# EasyEDA Pro project GController.eprj, schematic NController, sheets 11 to 17 of 17

## Sheets
11 Analog-Input: Create Date: 2024-10-03
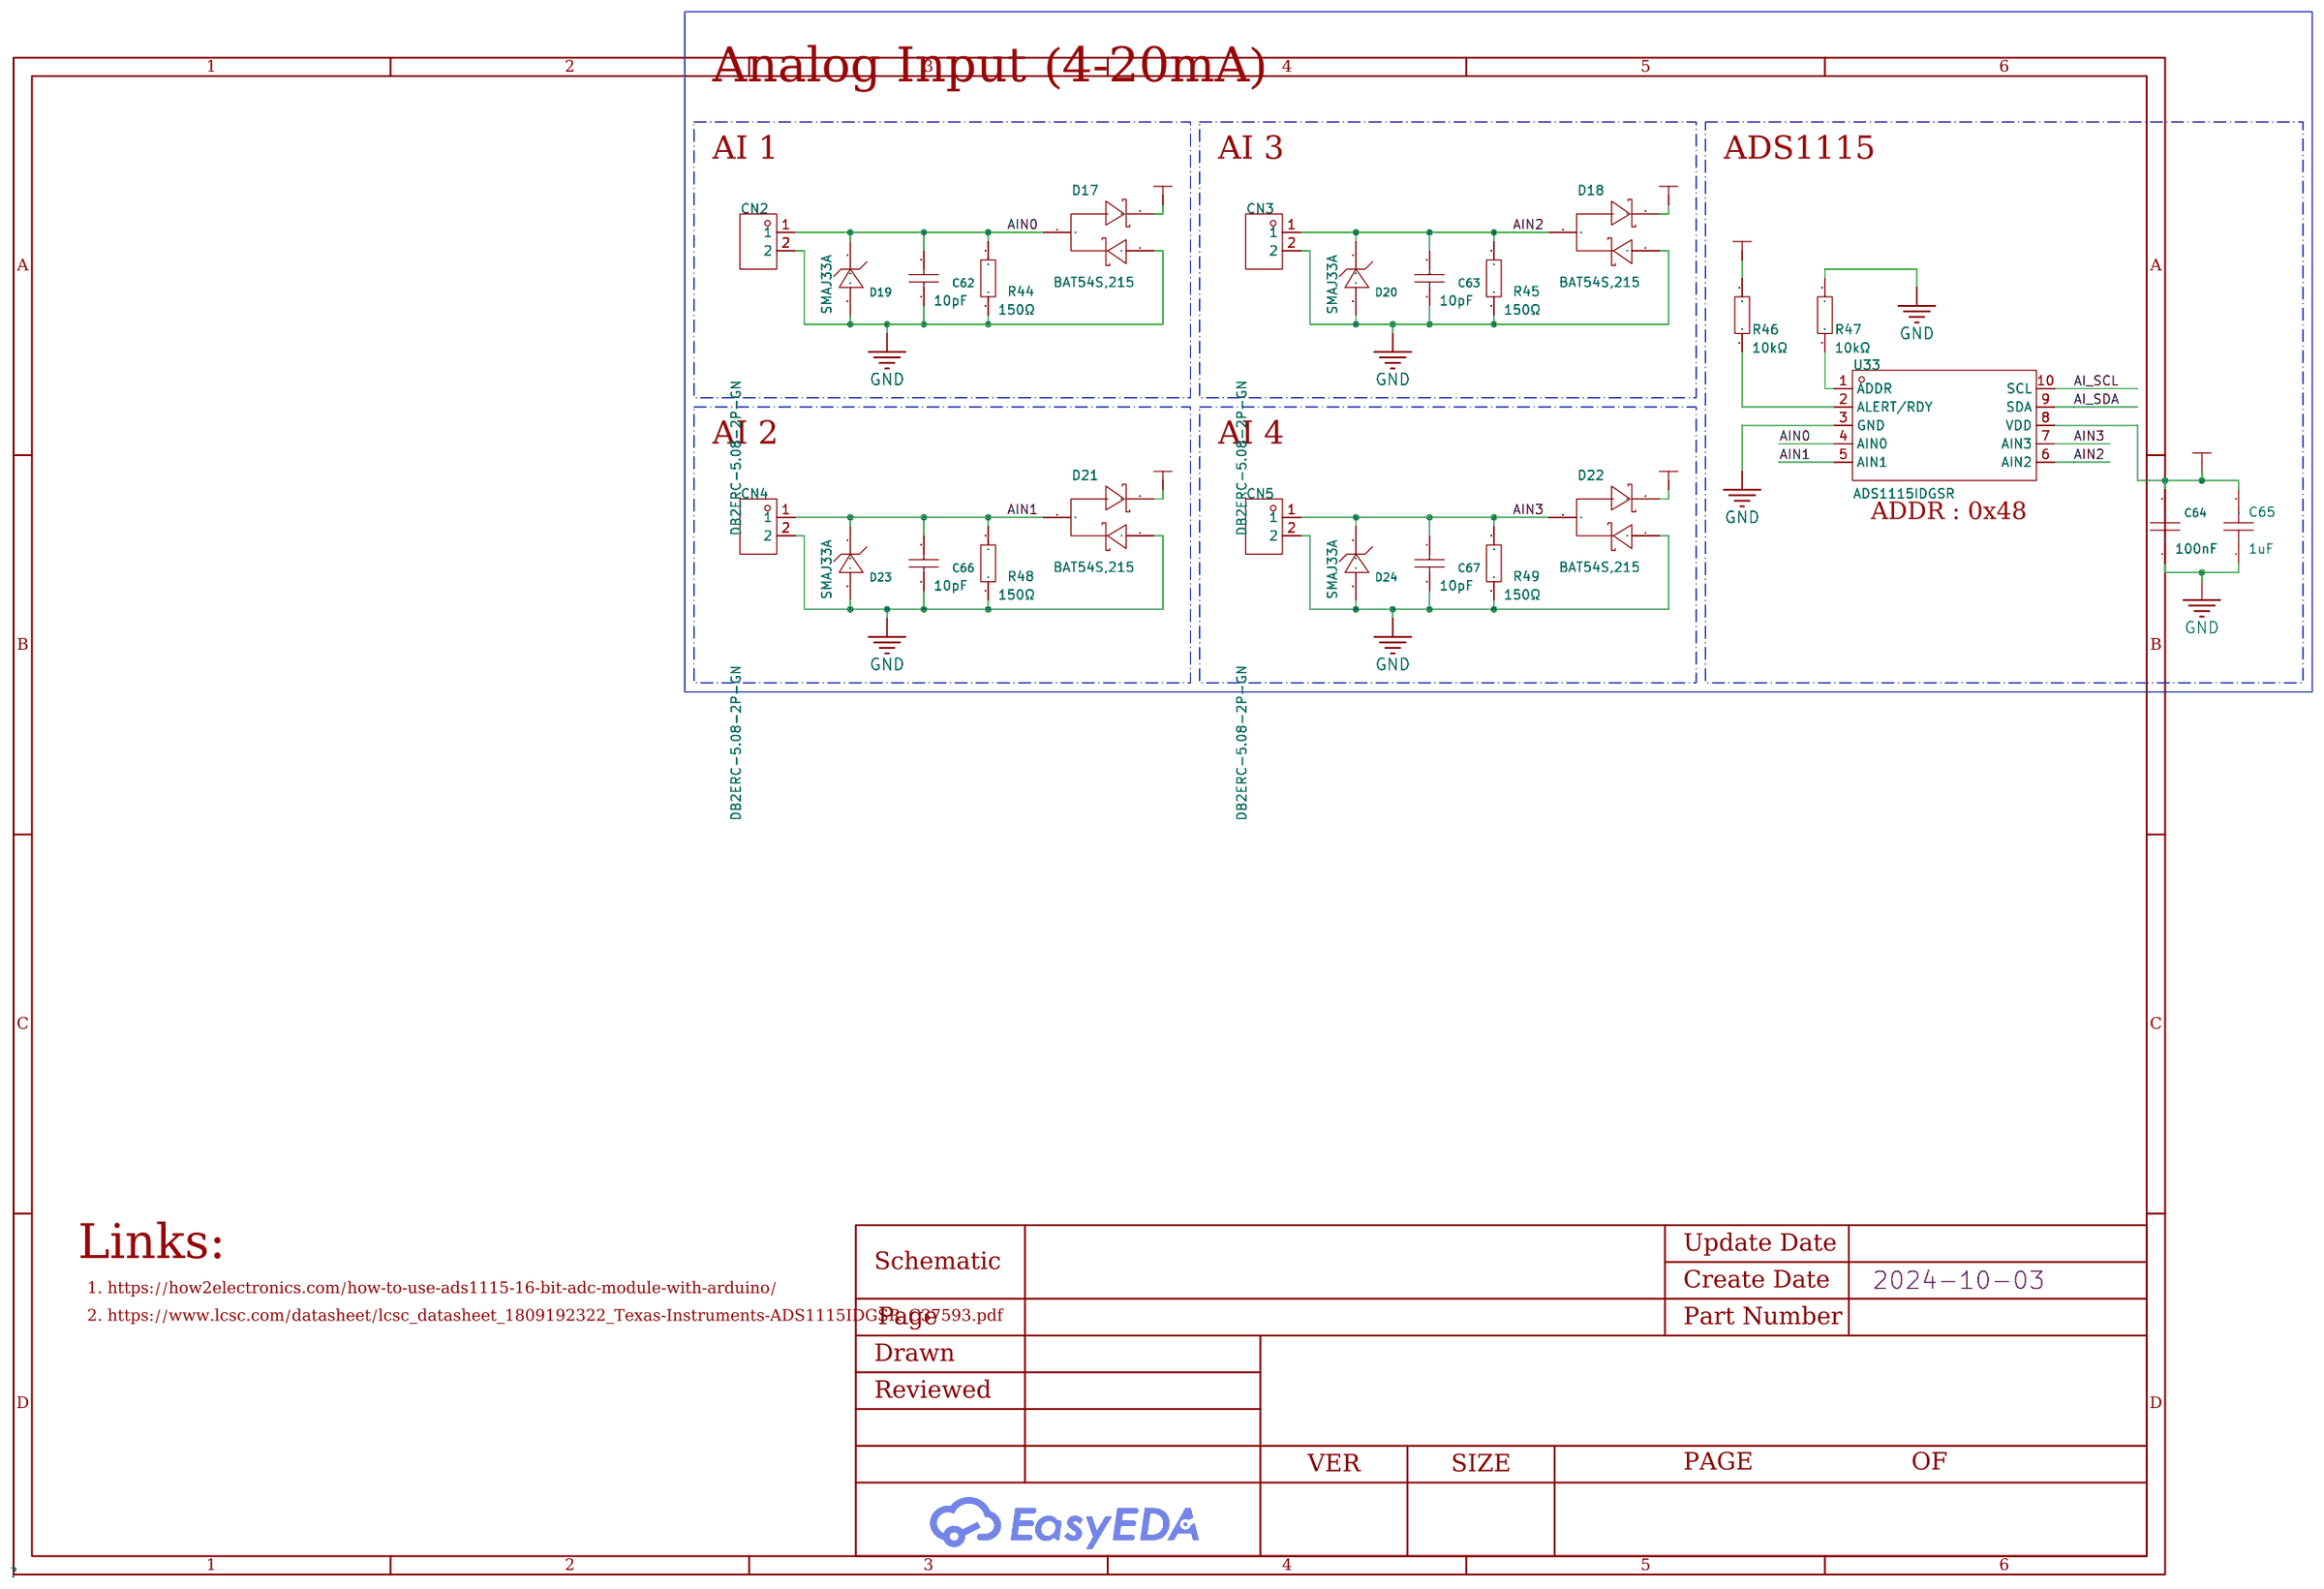
[diagram p10: Analog-Input]
12 Digital-Input: Create Date: 2024-10-06
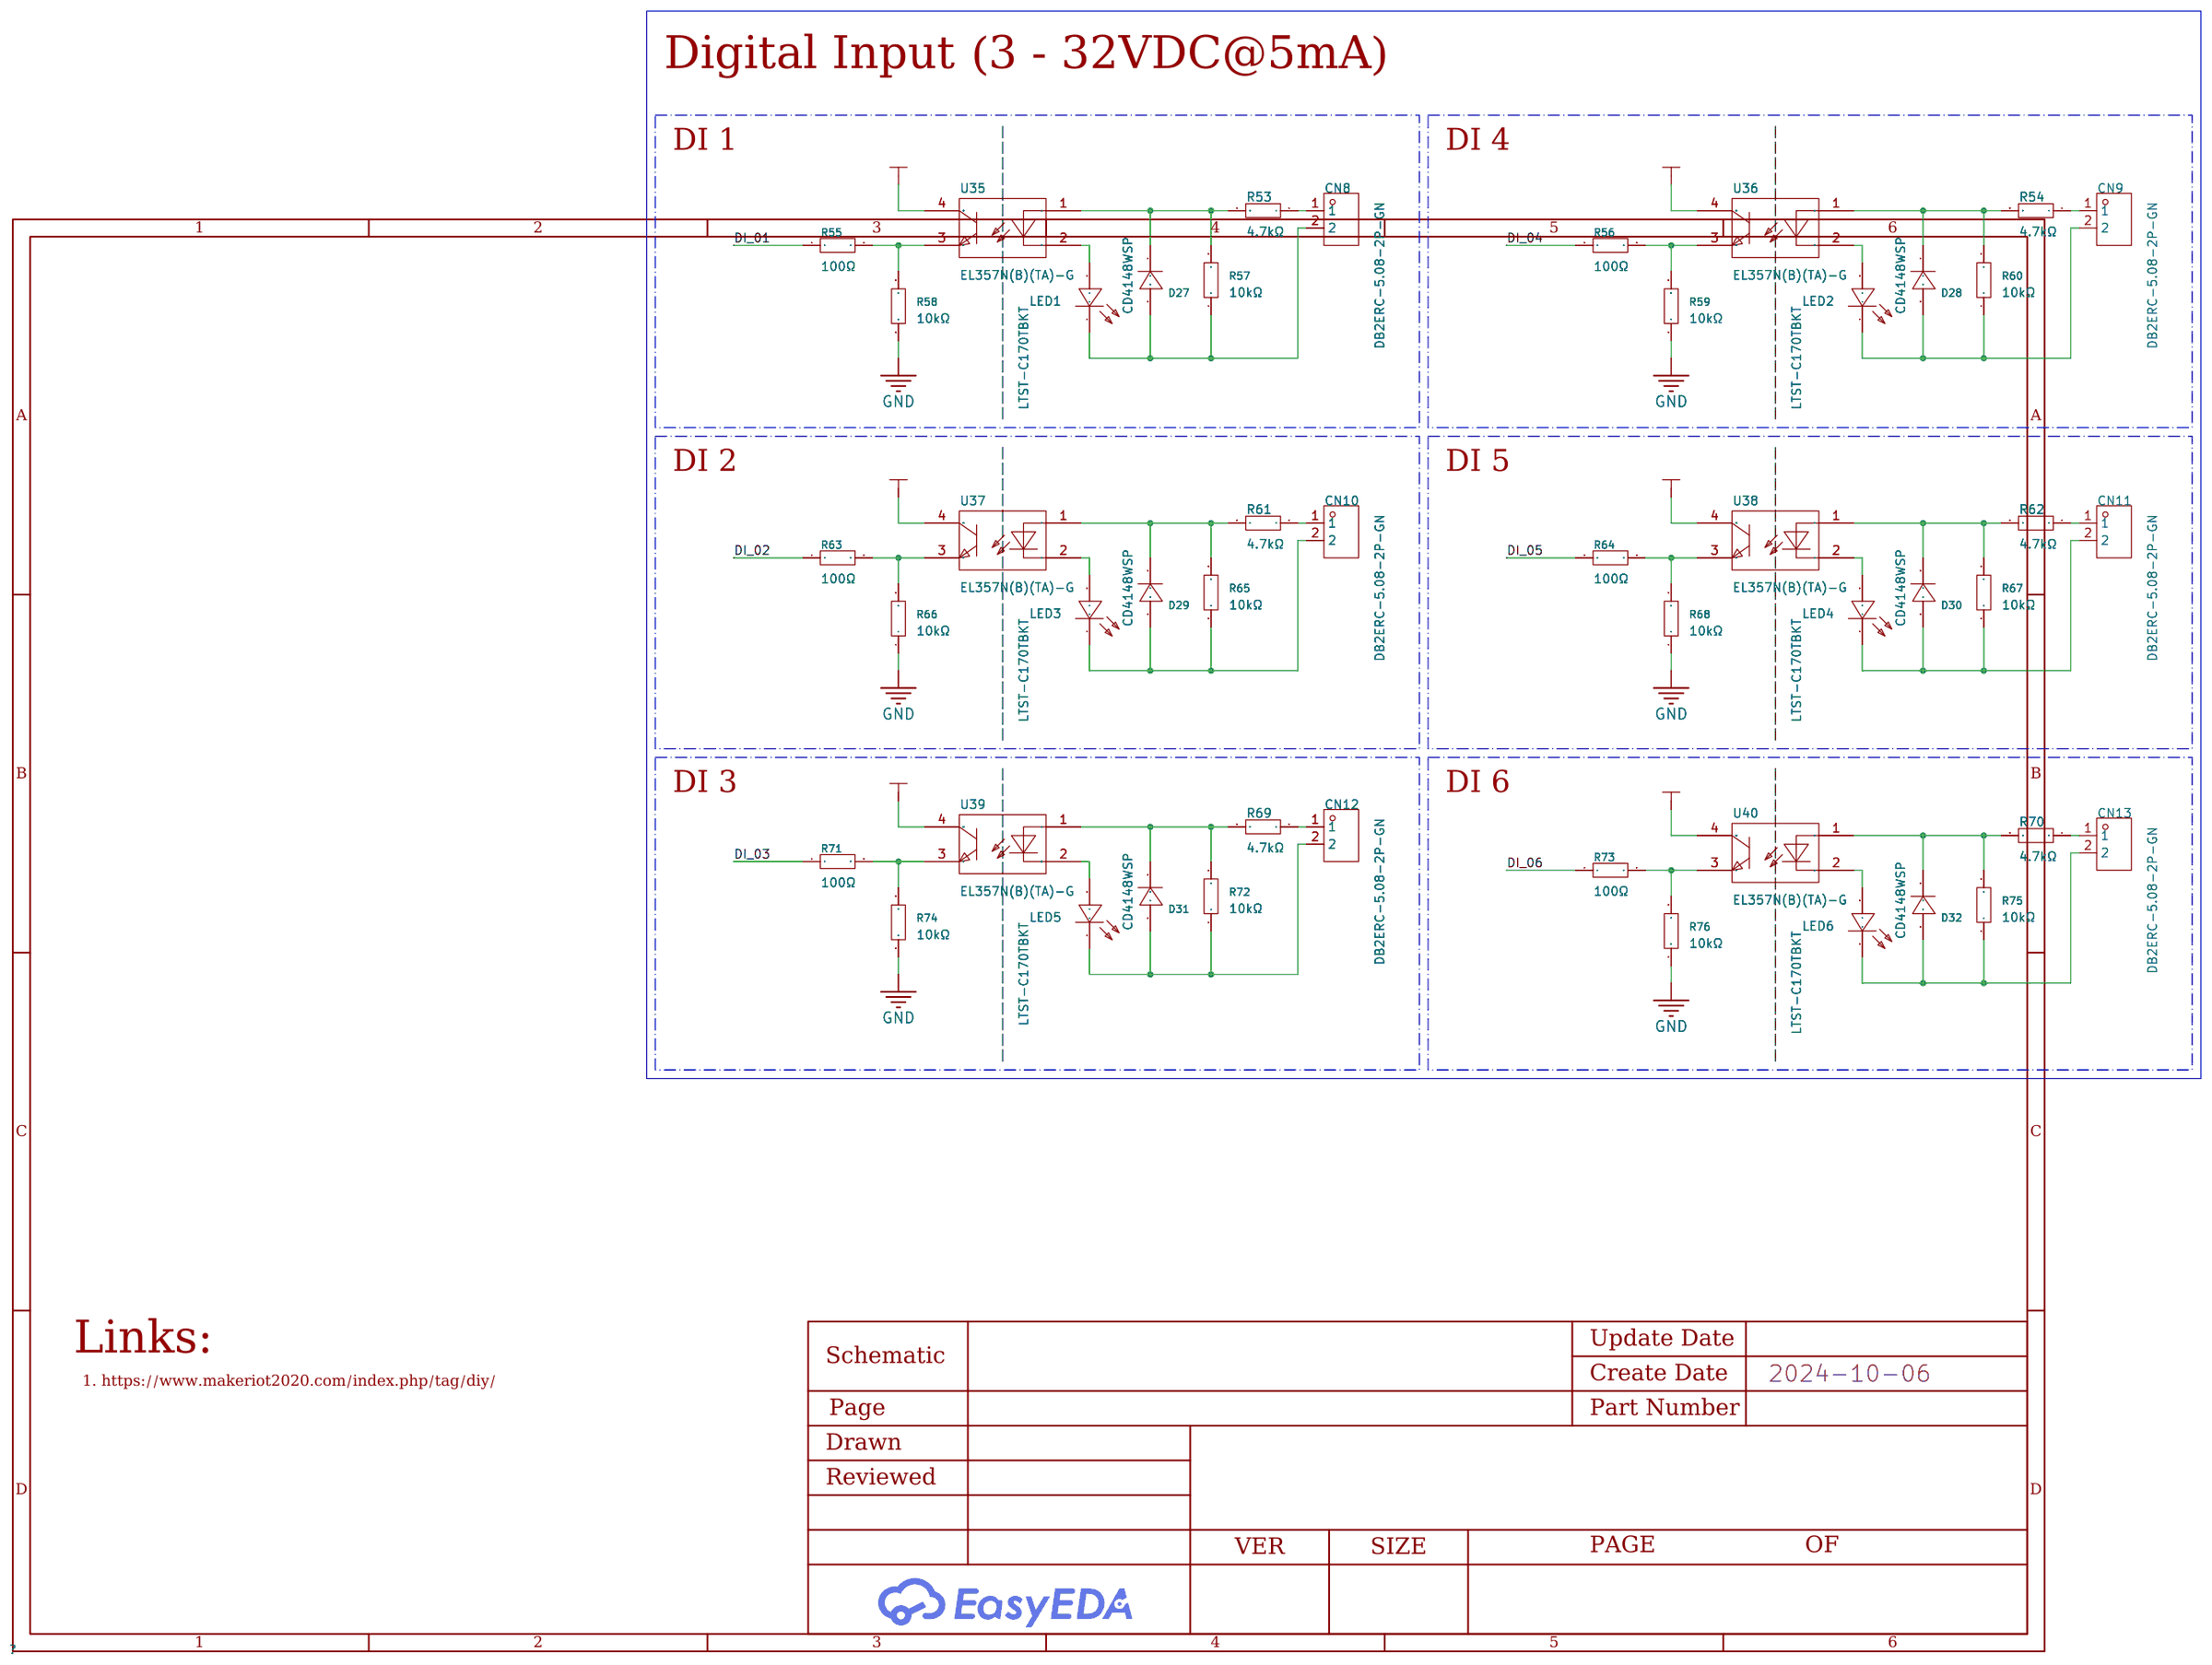
[diagram p11: Digital-Input]
13 Analog-Output: Create Date: 2024-10-07
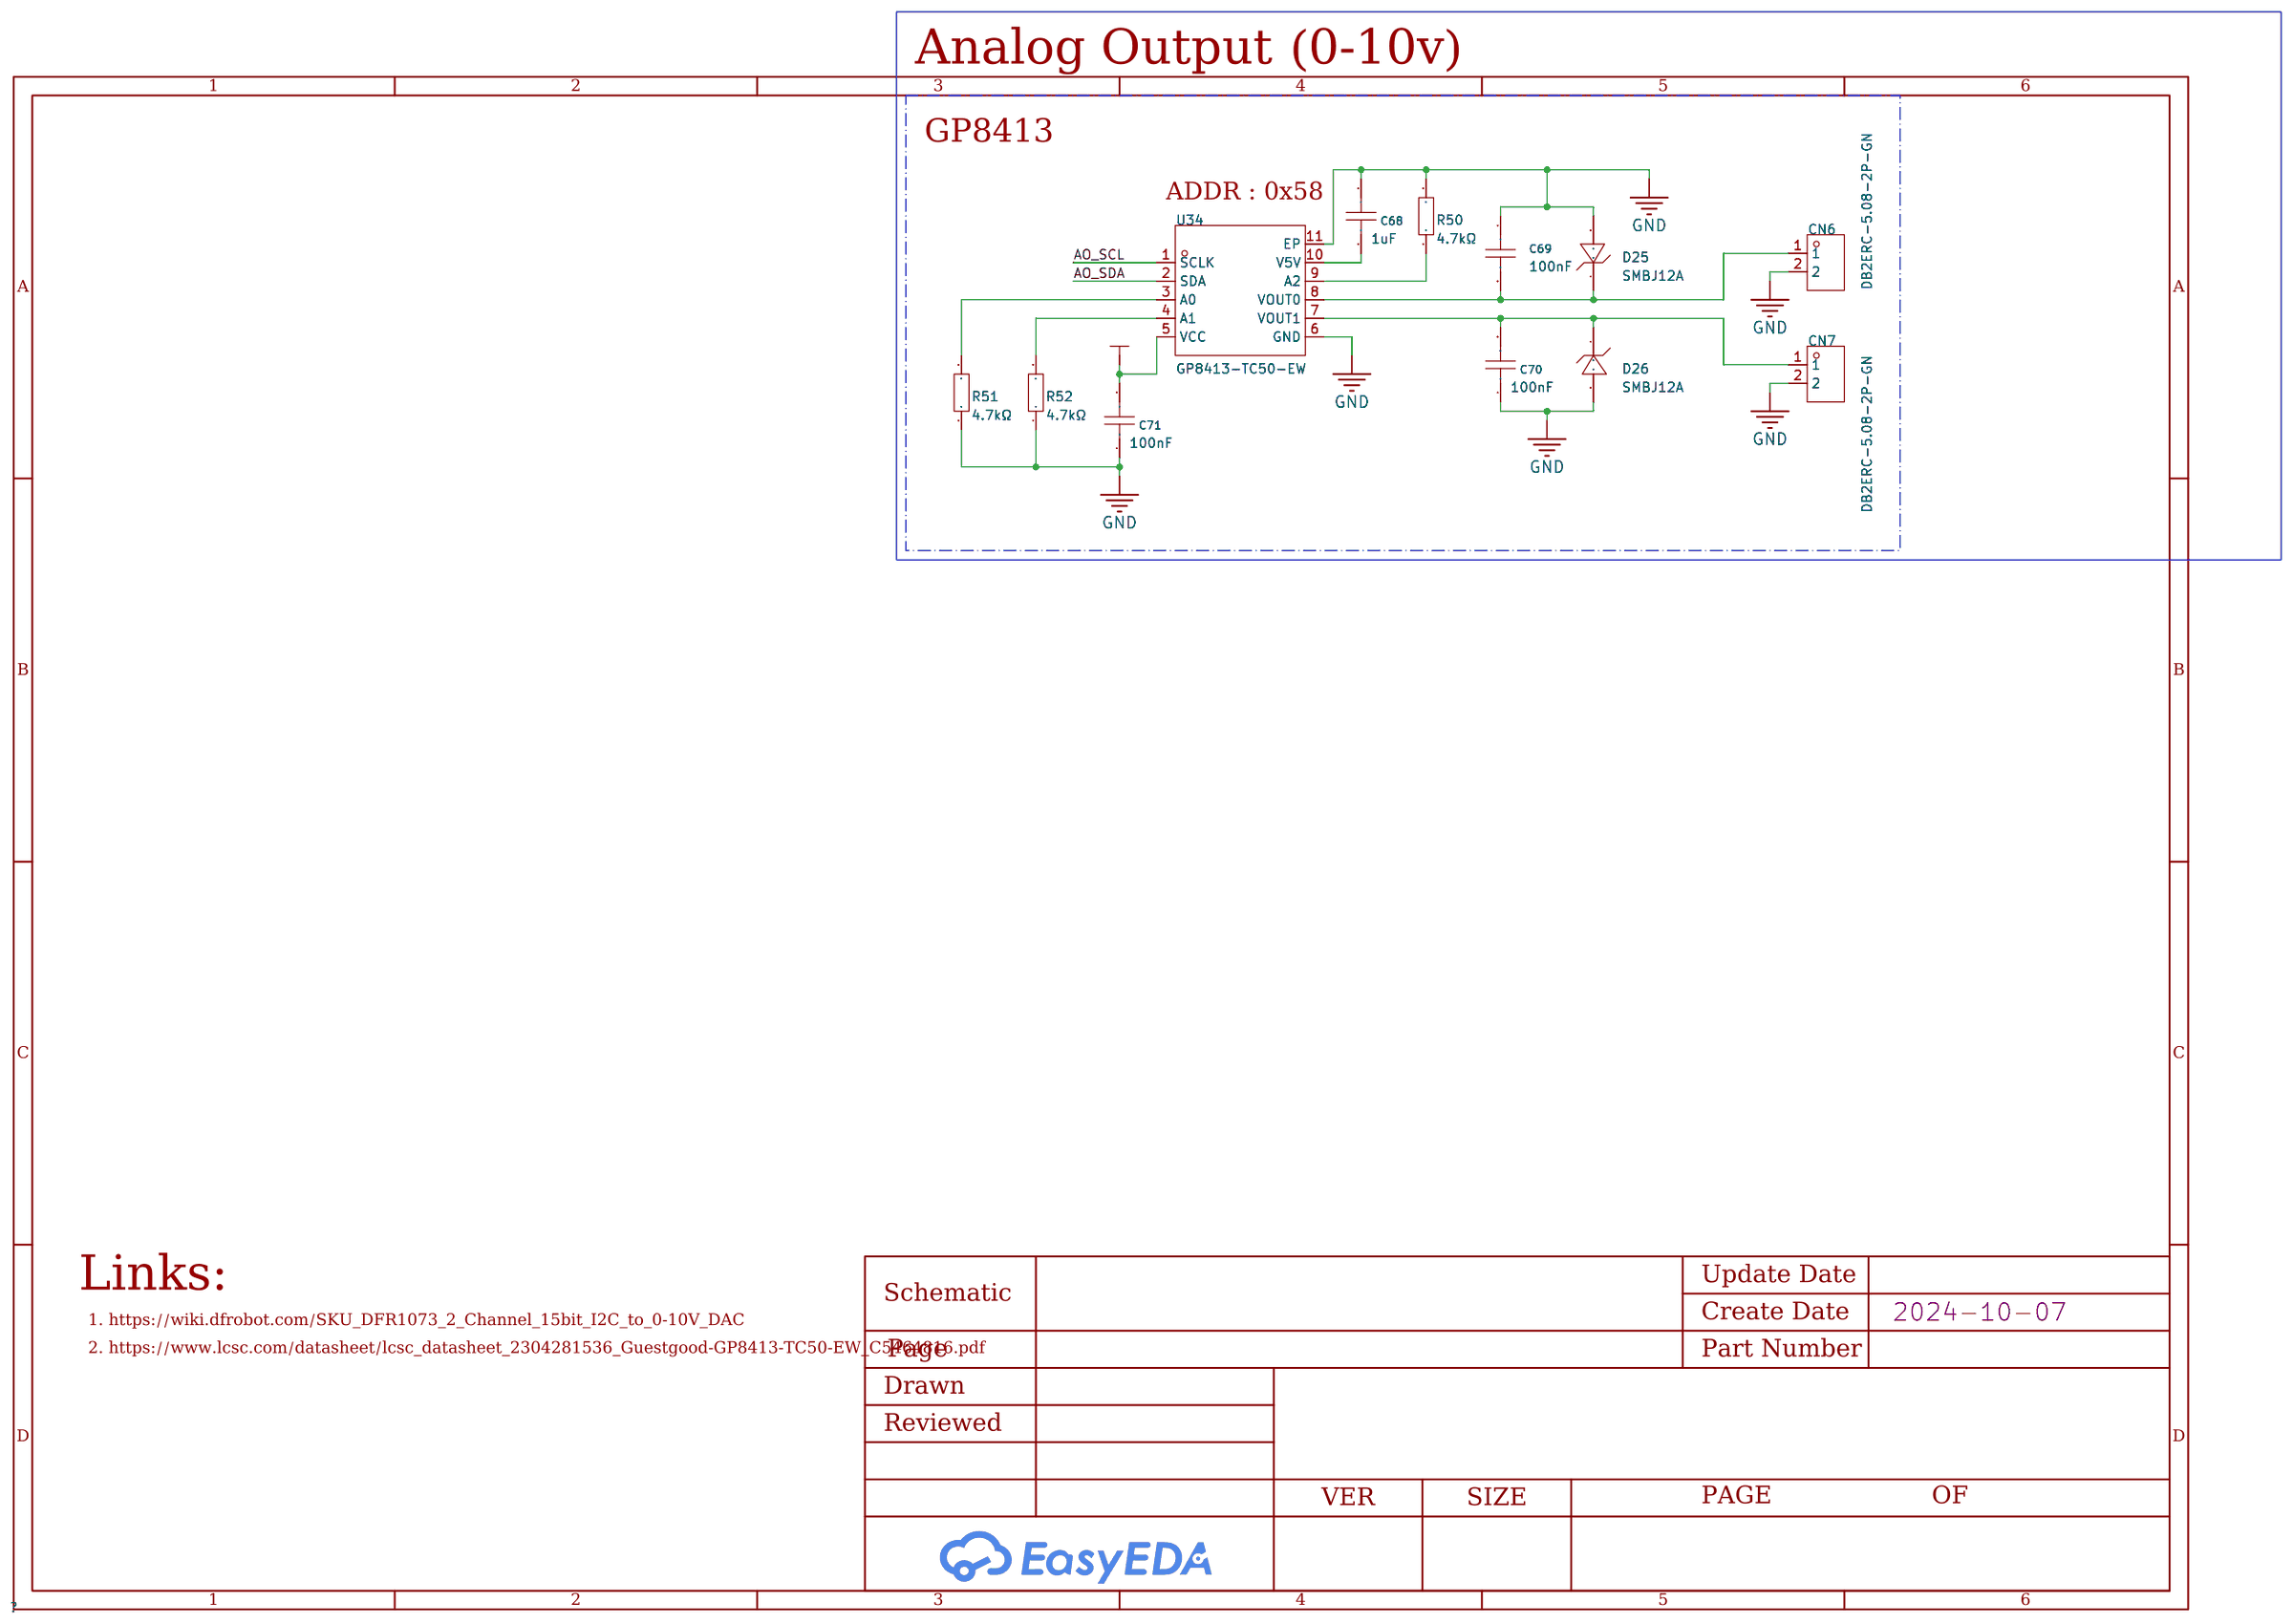
[diagram p12: Analog-Output]
14 Headers: Create Date: 2024-10-09
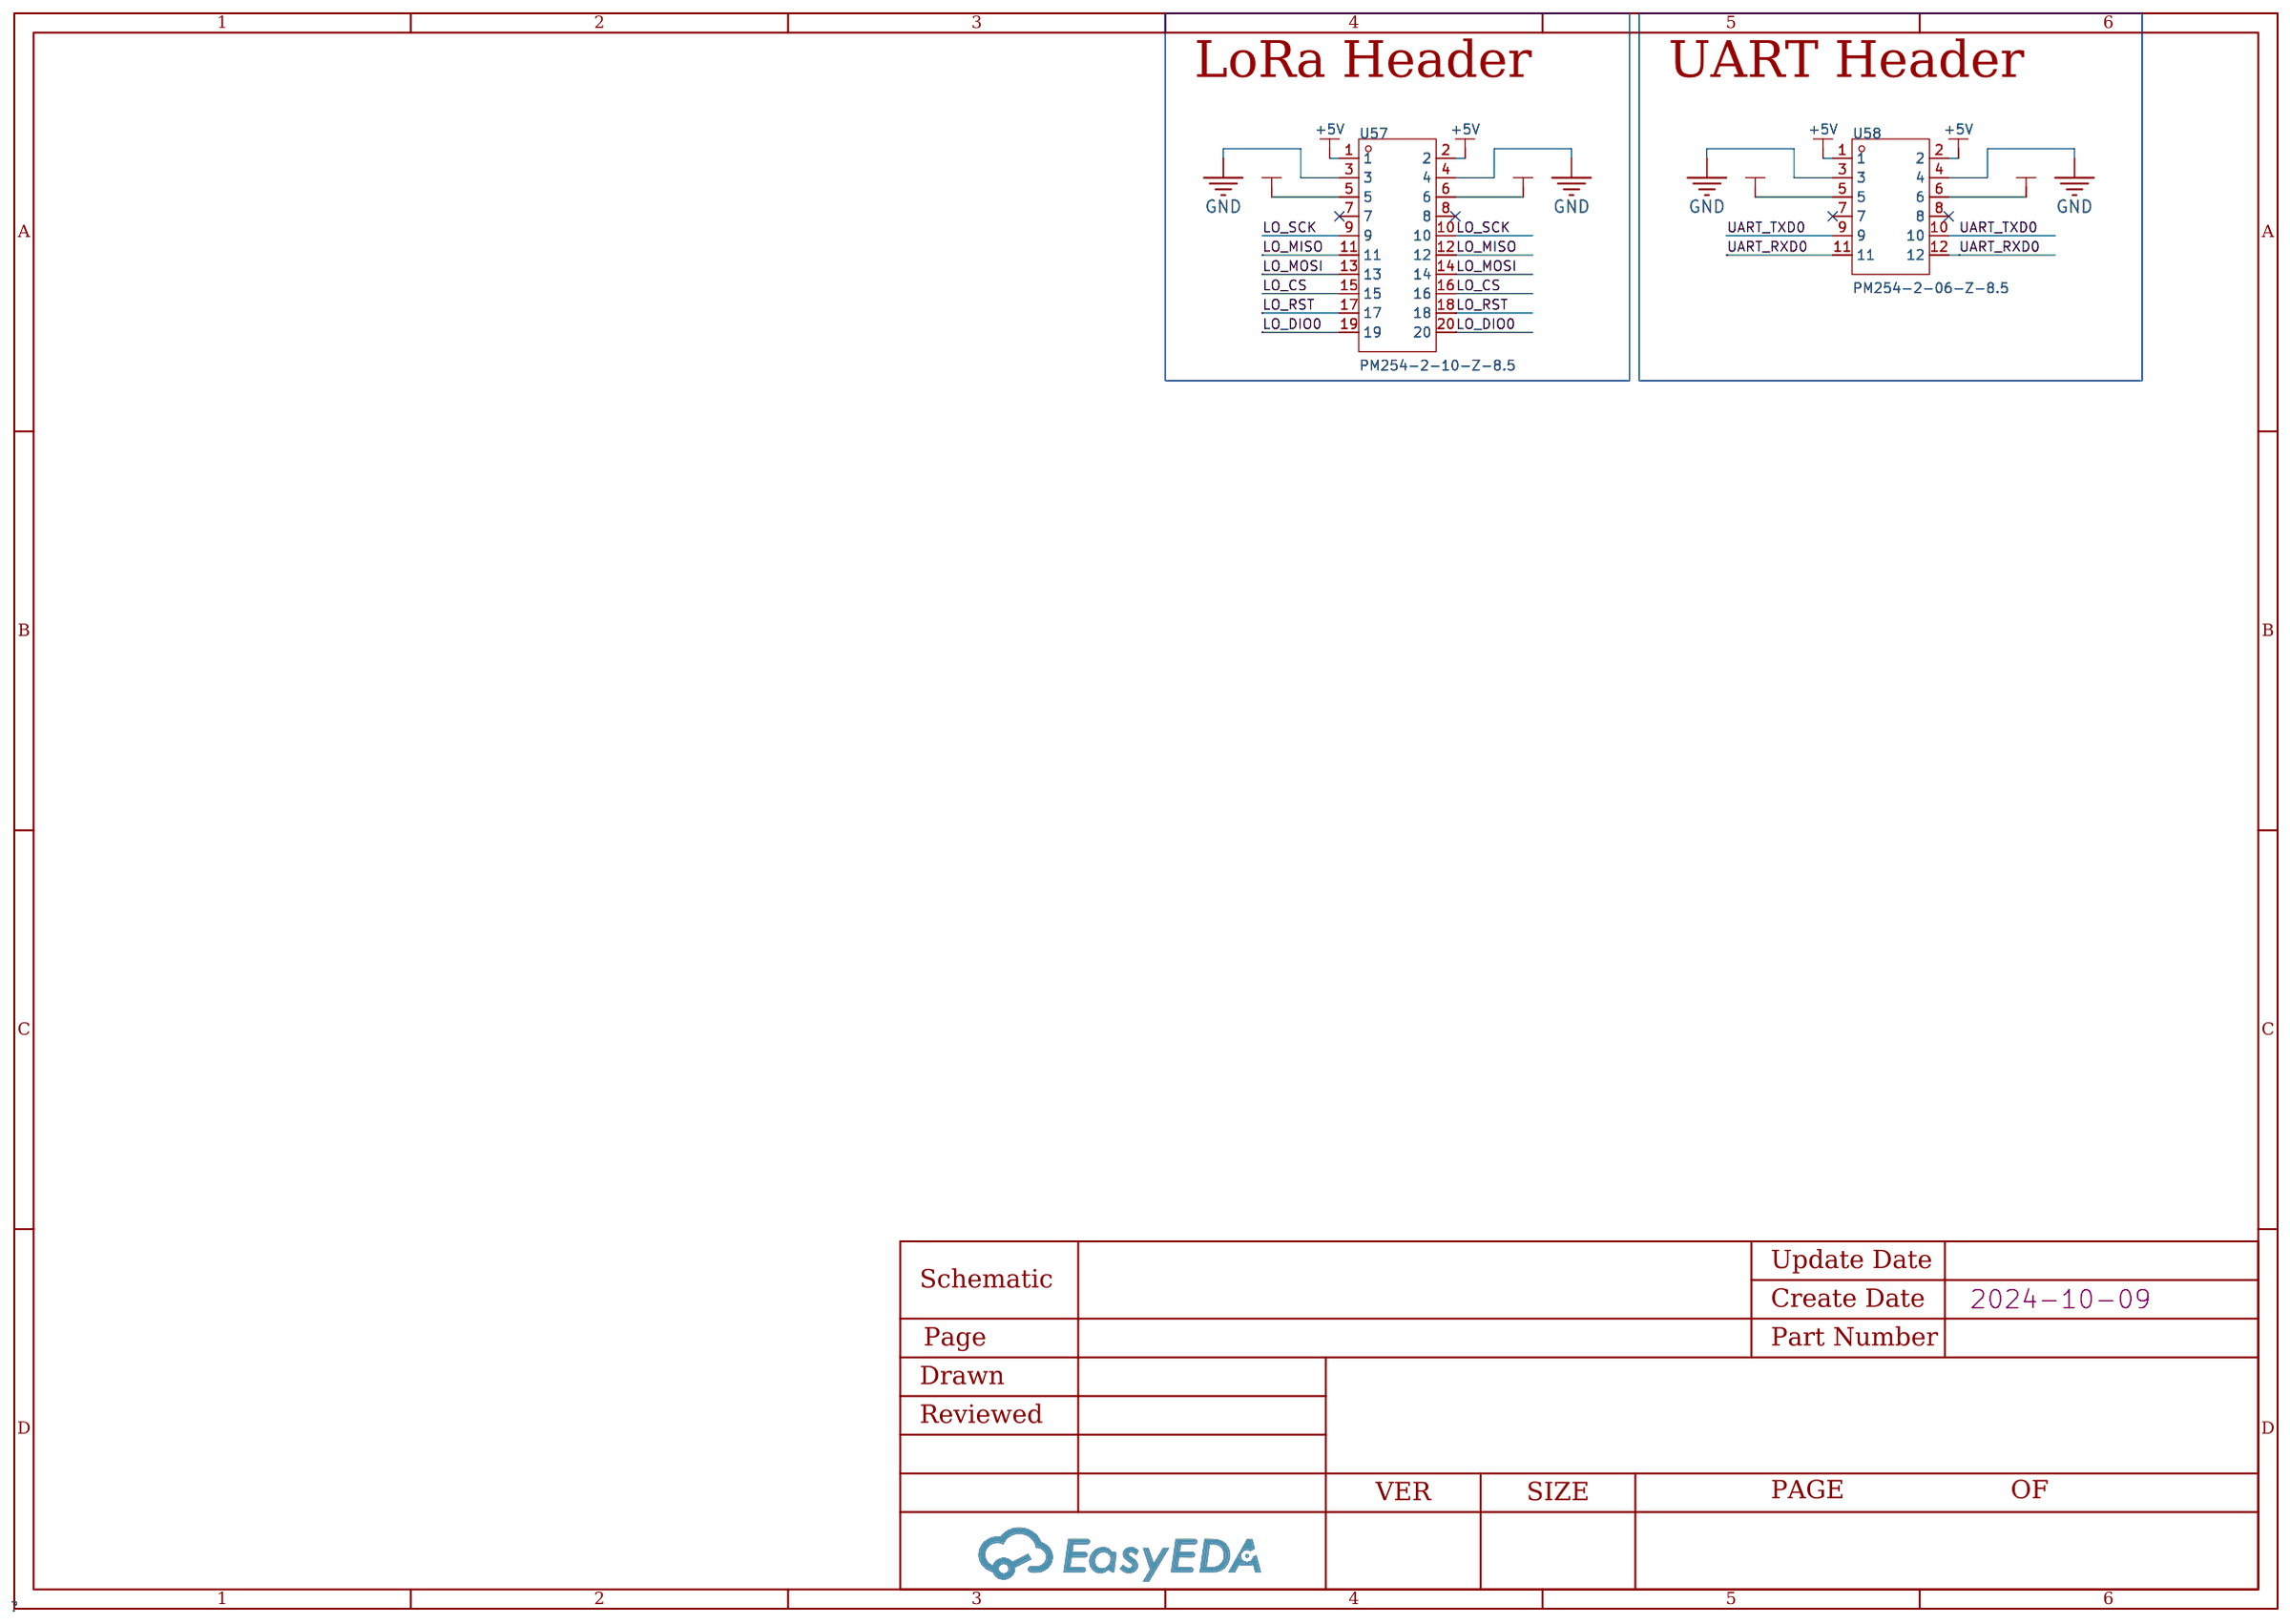
[diagram p13: Headers]
15 LED: Create Date: 2024-10-10
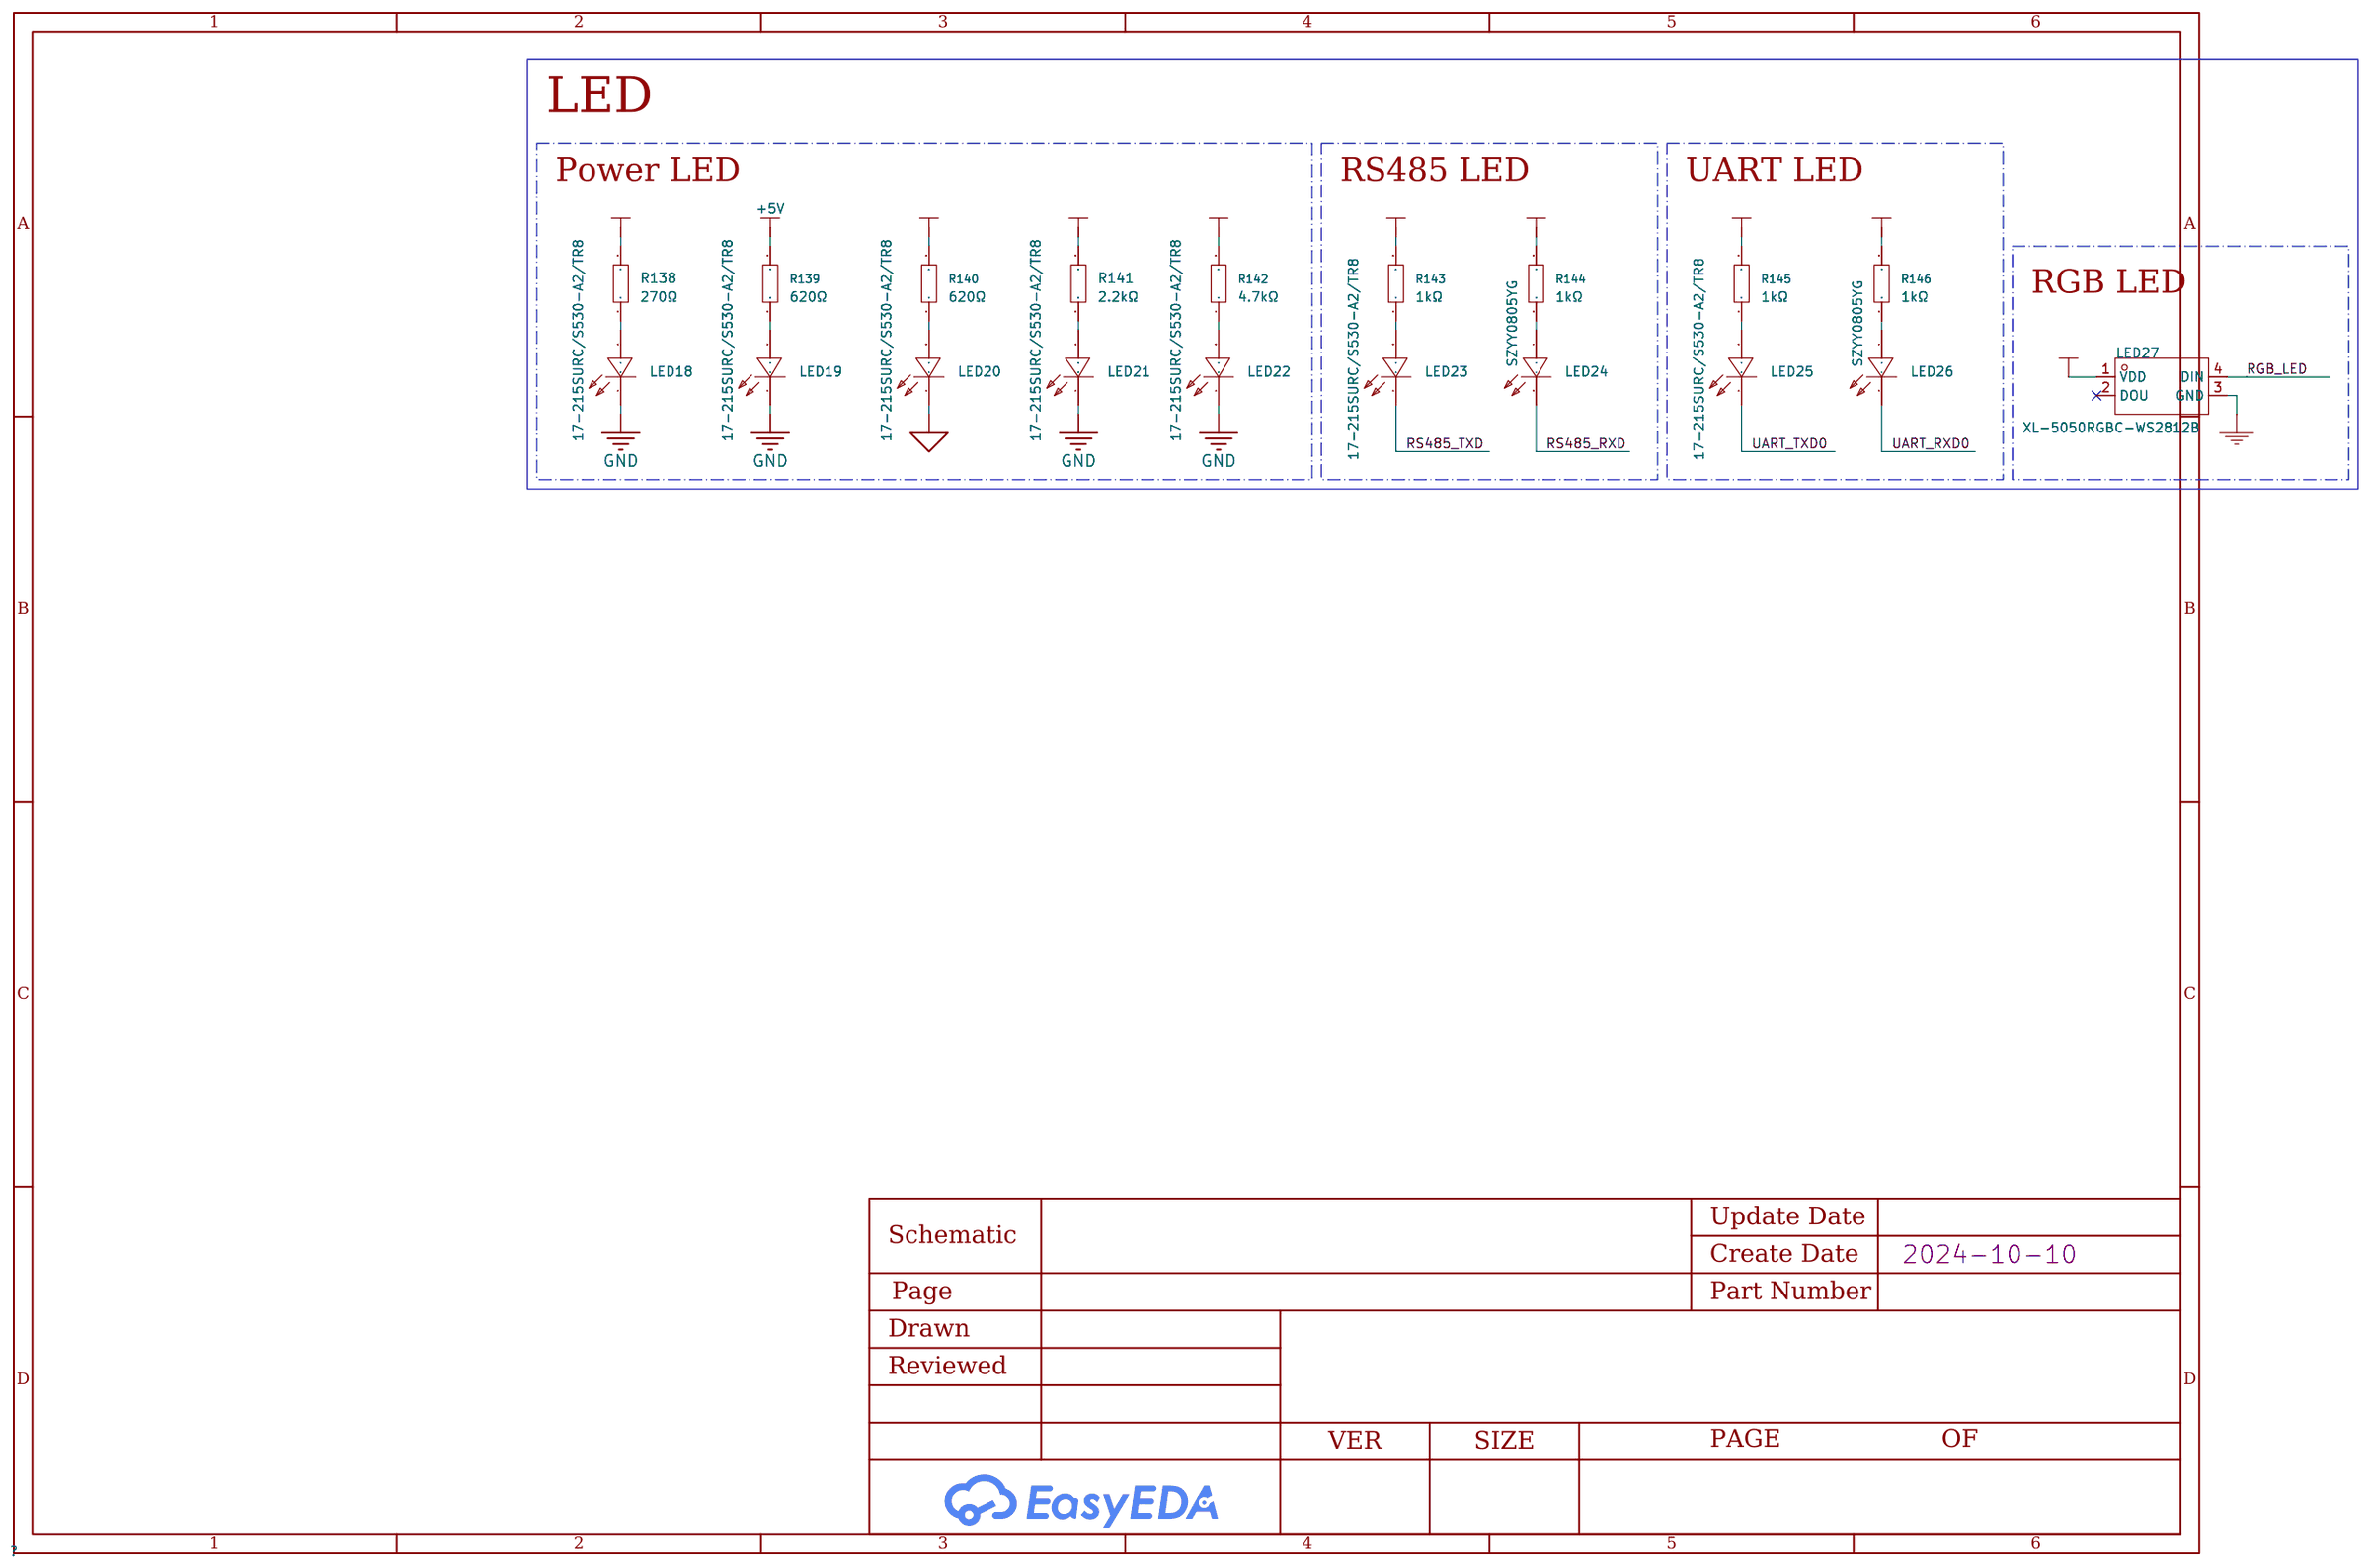
[diagram p14: LED]
16 Pilot-Lamp: Create Date: 2024-10-14
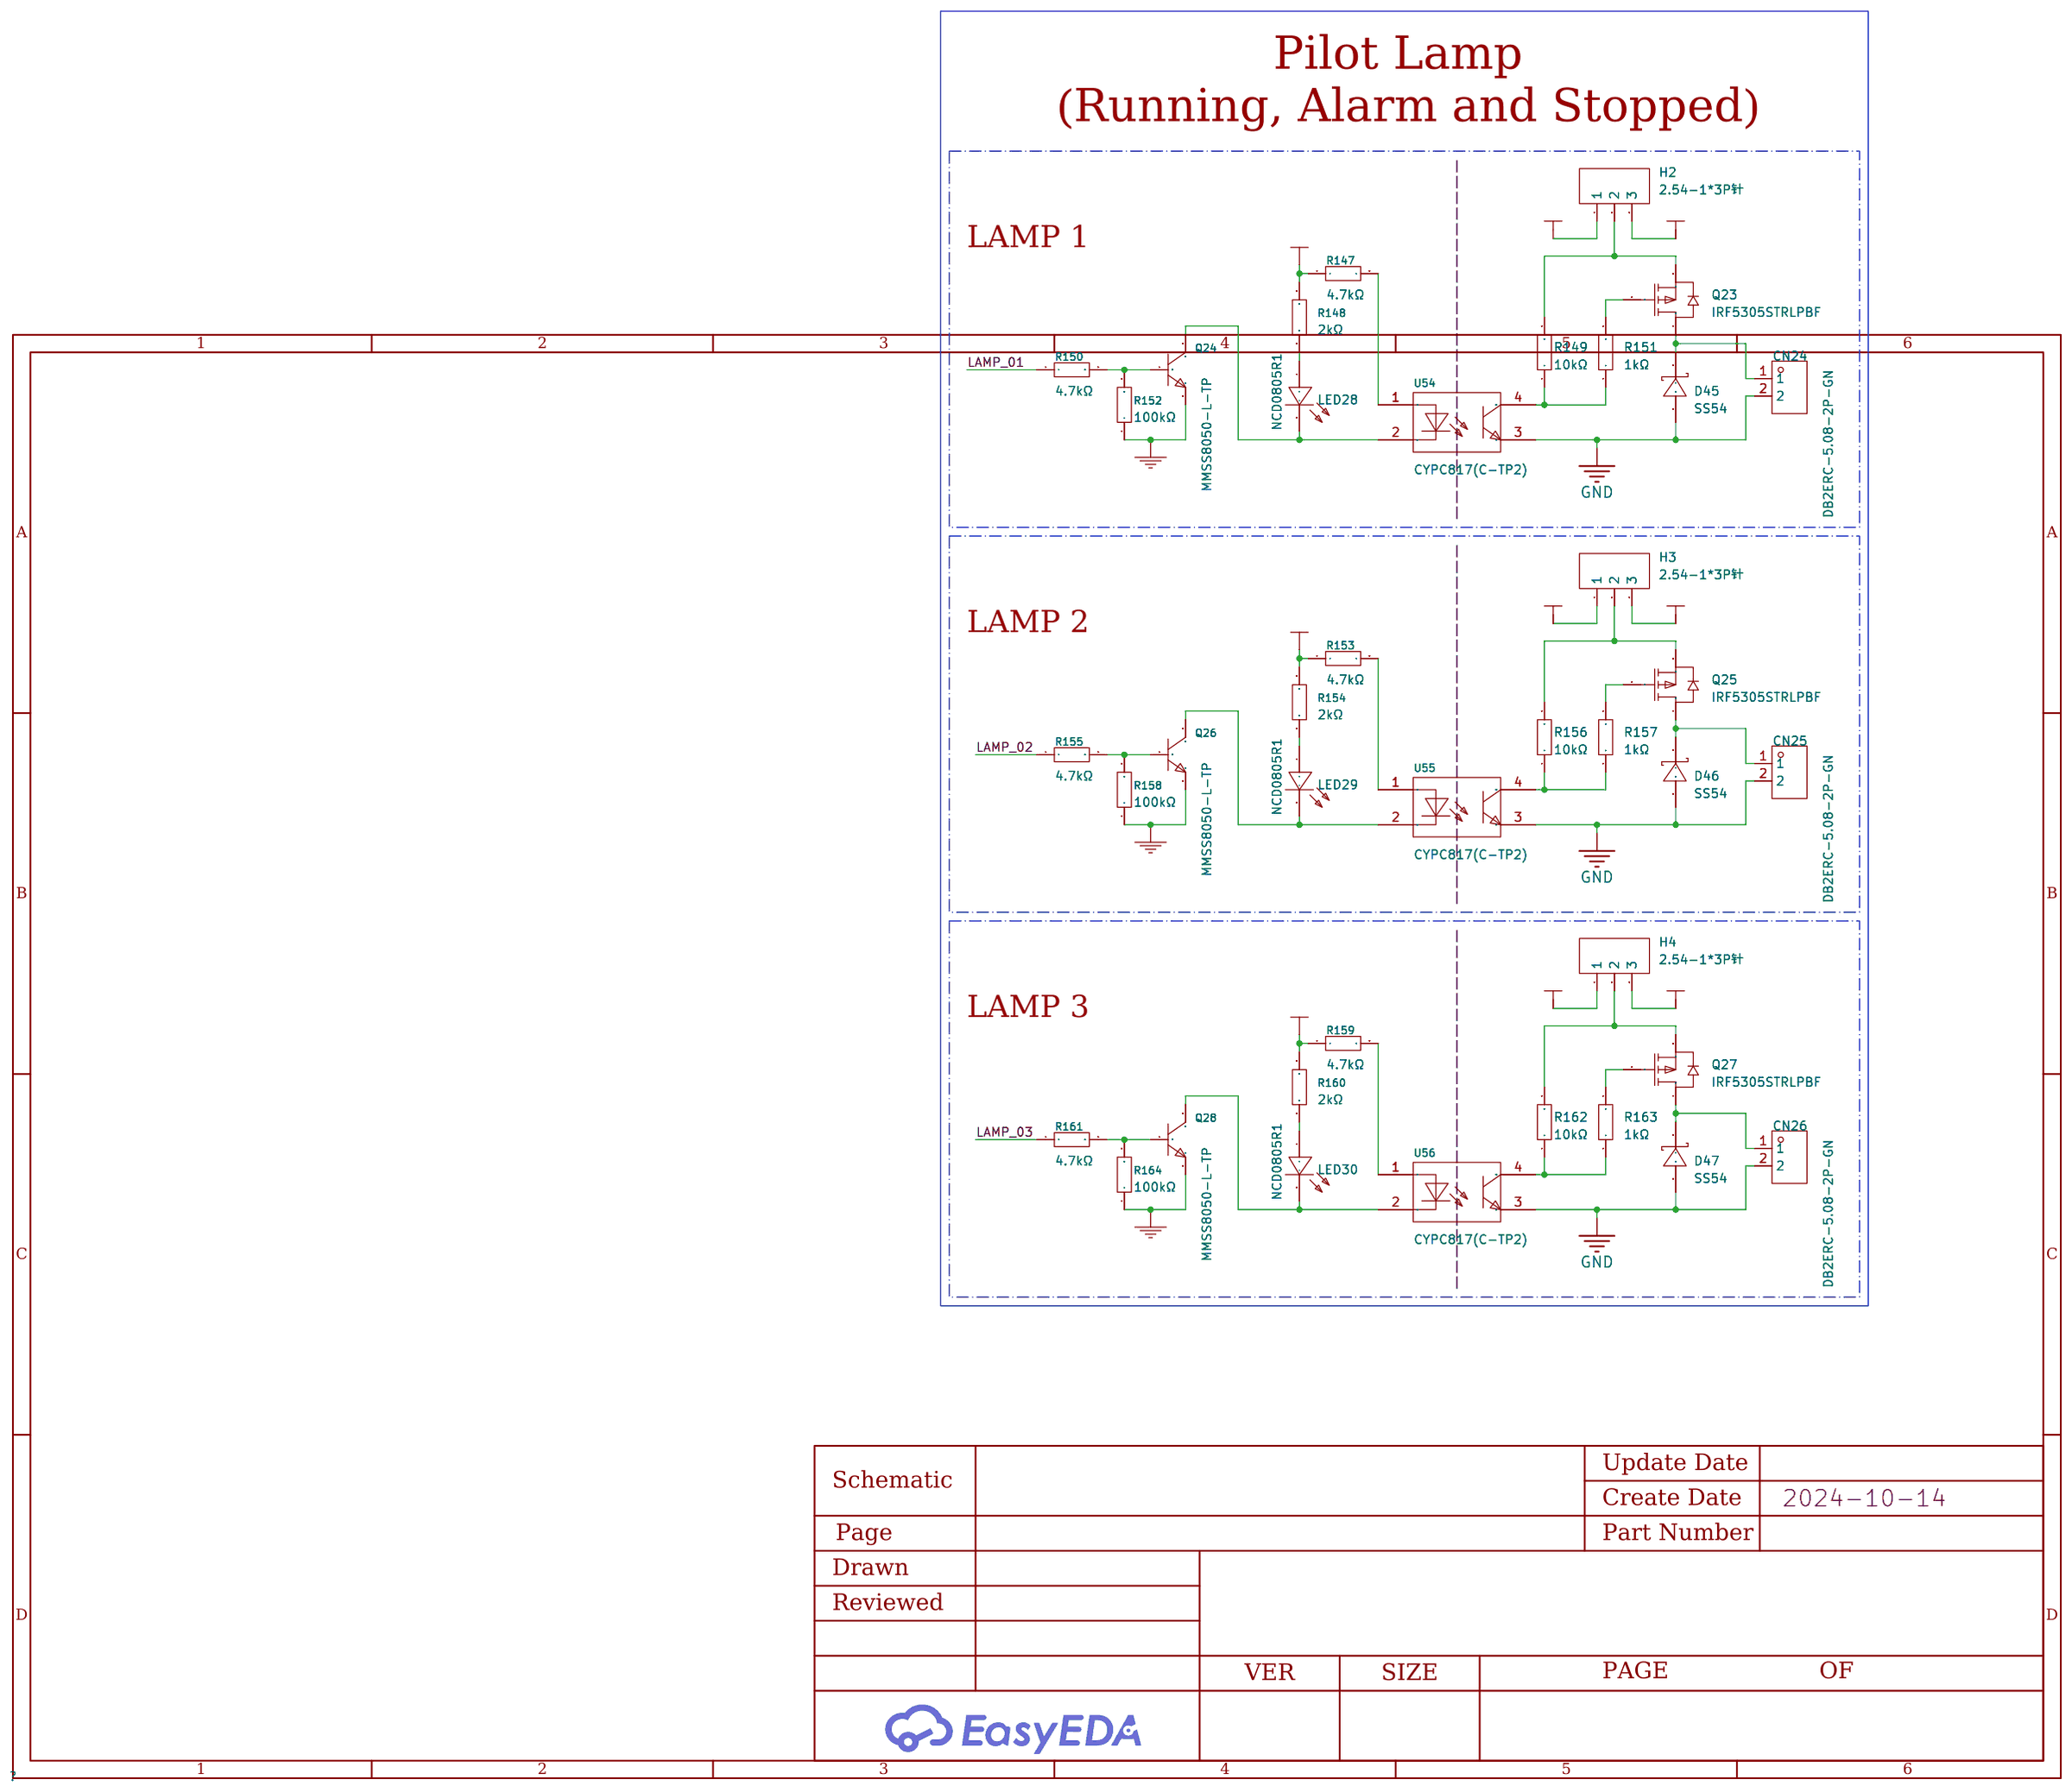
[diagram p15: Pilot-Lamp]
17 Temp/Pressure-Sensor: Create Date: 2024-10-15
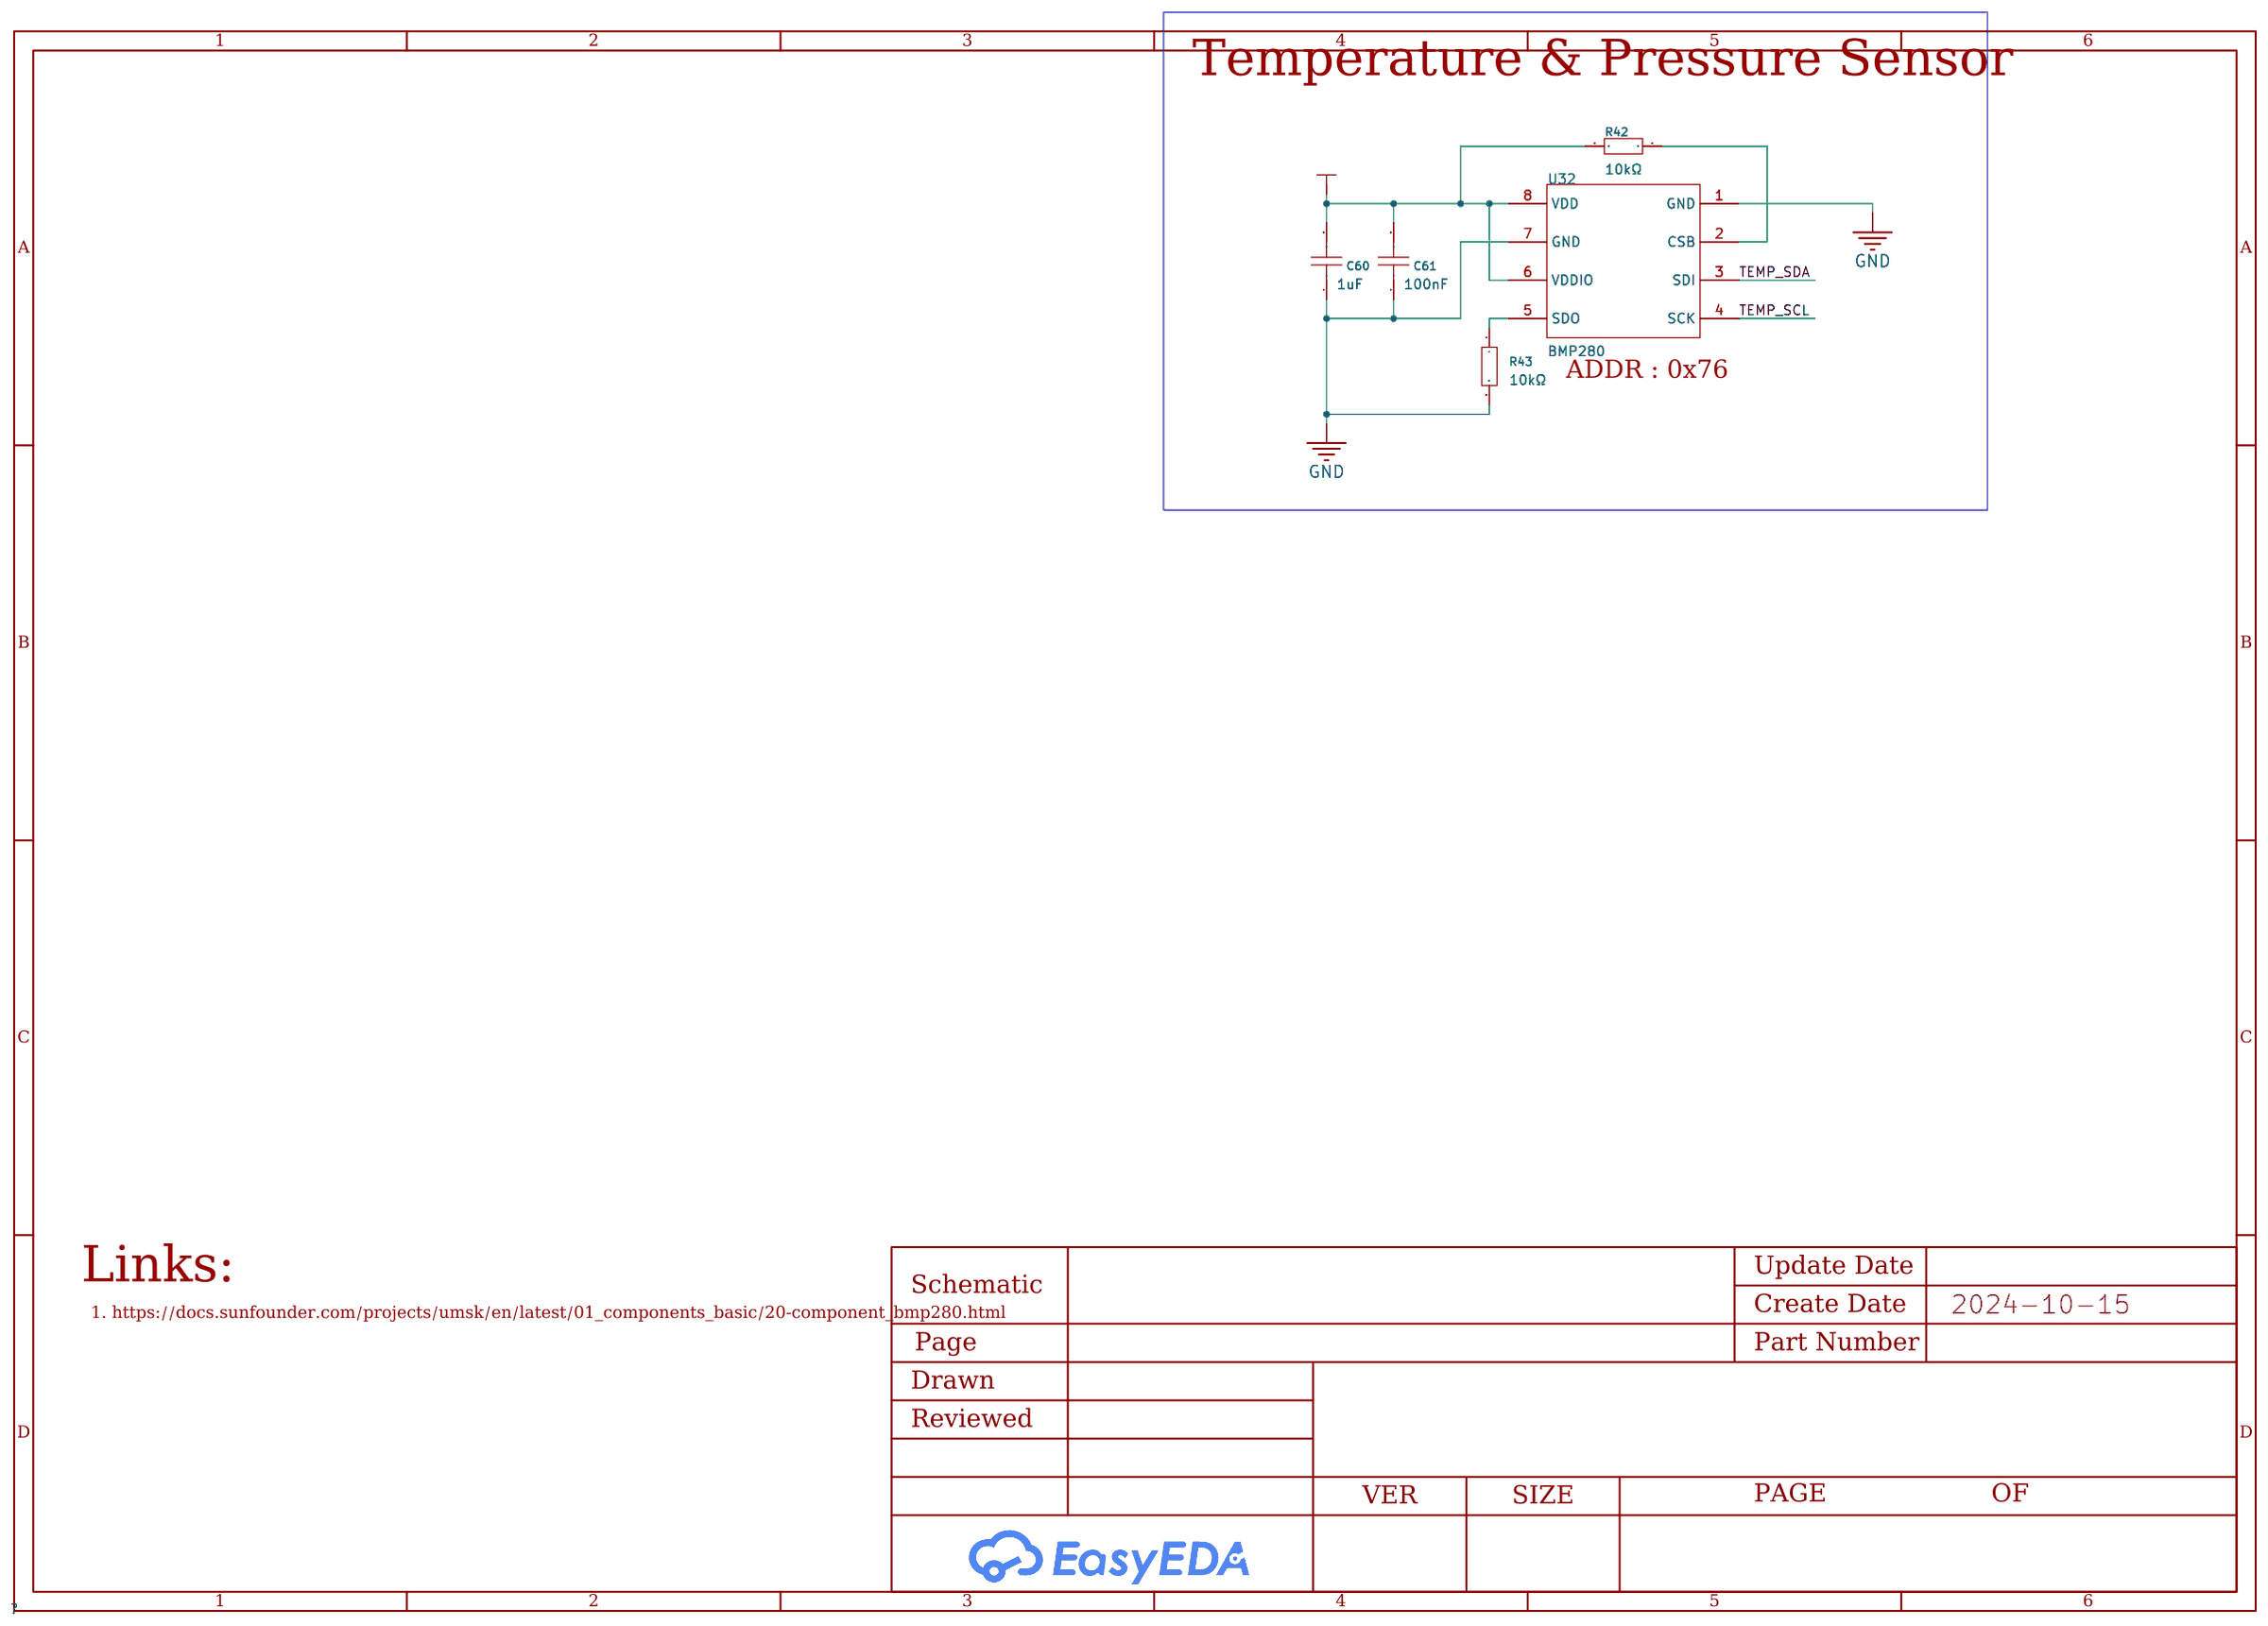
[diagram p16: Temp/Pressure-Sensor]

## Parts
sheet Analog-Input
C62  10pF  [C0603]
C63  10pF  [C0603]
C64  100nF  [C0402]
C65  1uF  [C0402]
C66  10pF  [C0603]
C67  10pF  [C0603]
CN2  DB2ERC-5.08-2P-GN  [CONN-TH_2P-P5.08_DB2ERC-5.08-2P]
CN3  DB2ERC-5.08-2P-GN  [CONN-TH_2P-P5.08_DB2ERC-5.08-2P]
CN4  DB2ERC-5.08-2P-GN  [CONN-TH_2P-P5.08_DB2ERC-5.08-2P]
CN5  DB2ERC-5.08-2P-GN  [CONN-TH_2P-P5.08_DB2ERC-5.08-2P]
D17  BAT54S,215  [SOT-23-3_L3.0-W1.7-P0.95-LS2.9-BR]
D18  BAT54S,215  [SOT-23-3_L3.0-W1.7-P0.95-LS2.9-BR]
D19  SMAJ33A  [SMA_L4.3-W2.6-LS5.2-RD]
D20  SMAJ33A  [SMA_L4.3-W2.6-LS5.2-RD]
D21  BAT54S,215  [SOT-23-3_L3.0-W1.7-P0.95-LS2.9-BR]
D22  BAT54S,215  [SOT-23-3_L3.0-W1.7-P0.95-LS2.9-BR]
D23  SMAJ33A  [SMA_L4.3-W2.6-LS5.2-RD]
D24  SMAJ33A  [SMA_L4.3-W2.6-LS5.2-RD]
R44  150Ω  [R0603]
R45  150Ω  [R0603]
R46  10kΩ  [R0603]
R47  10kΩ  [R0603]
R48  150Ω  [R0603]
R49  150Ω  [R0603]
U33  ADS1115IDGSR  [MSOP-10_L3.0-W3.0-P0.50-LS5.0-BL]
sheet Analog-Output
C68  1uF  [C0603]
C69  100nF  [C0603]
C70  100nF  [C0603]
C71  100nF  [C0603]
CN6  DB2ERC-5.08-2P-GN  [CONN-TH_2P-P5.08_DB2ERC-5.08-2P]
CN7  DB2ERC-5.08-2P-GN  [CONN-TH_2P-P5.08_DB2ERC-5.08-2P]
D25  SMBJ12A  [SMB_L4.6-W3.6-LS5.3-RD]
D26  SMBJ12A  [SMB_L4.6-W3.6-LS5.3-RD]
R50  4.7kΩ  [R0603]
R51  4.7kΩ  [R0603]
R52  4.7kΩ  [R0603]
U34  GP8413-TC50-EW  [ESOP-10_L4.9-W3.9-P1.00-LS6.0-BL-EP]
sheet Digital-Input
CN8  DB2ERC-5.08-2P-GN  [CONN-TH_2P-P5.08_DB2ERC-5.08-2P]
CN9  DB2ERC-5.08-2P-GN  [CONN-TH_2P-P5.08_DB2ERC-5.08-2P]
CN10  DB2ERC-5.08-2P-GN  [CONN-TH_2P-P5.08_DB2ERC-5.08-2P]
CN11  DB2ERC-5.08-2P-GN  [CONN-TH_2P-P5.08_DB2ERC-5.08-2P]
CN12  DB2ERC-5.08-2P-GN  [CONN-TH_2P-P5.08_DB2ERC-5.08-2P]
CN13  DB2ERC-5.08-2P-GN  [CONN-TH_2P-P5.08_DB2ERC-5.08-2P]
D27  CD4148WSP  [D0805-RD]
D28  CD4148WSP  [D0805-RD]
D29  CD4148WSP  [D0805-RD]
D30  CD4148WSP  [D0805-RD]
D31  CD4148WSP  [D0805-RD]
D32  CD4148WSP  [D0805-RD]
LED1  LTST-C170TBKT  [LED0805-RD_BLUE]
LED2  LTST-C170TBKT  [LED0805-RD_BLUE]
LED3  LTST-C170TBKT  [LED0805-RD_BLUE]
LED4  LTST-C170TBKT  [LED0805-RD_BLUE]
LED5  LTST-C170TBKT  [LED0805-RD_BLUE]
LED6  LTST-C170TBKT  [LED0805-RD_BLUE]
R53  4.7kΩ  [R0805]
R54  4.7kΩ  [R0805]
R55  100Ω  [R0805]
R56  100Ω  [R0805]
R57  10kΩ  [R0805]
R58  10kΩ  [R0805]
R59  10kΩ  [R0805]
R60  10kΩ  [R0805]
R61  4.7kΩ  [R0805]
R62  4.7kΩ  [R0805]
R63  100Ω  [R0805]
R64  100Ω  [R0805]
R65  10kΩ  [R0805]
R66  10kΩ  [R0805]
R67  10kΩ  [R0805]
R68  10kΩ  [R0805]
R69  4.7kΩ  [R0805]
R70  4.7kΩ  [R0805]
R71  100Ω  [R0805]
R72  10kΩ  [R0805]
R73  100Ω  [R0805]
R74  10kΩ  [R0805]
R75  10kΩ  [R0805]
R76  10kΩ  [R0805]
U35  EL357N(B)(TA)-G  [OPTO-SMD-4_L4.4-W4.1-P2.54-LS7.0-TL]
U36  EL357N(B)(TA)-G  [OPTO-SMD-4_L4.4-W4.1-P2.54-LS7.0-TL]
U37  EL357N(B)(TA)-G  [OPTO-SMD-4_L4.4-W4.1-P2.54-LS7.0-TL]
U38  EL357N(B)(TA)-G  [OPTO-SMD-4_L4.4-W4.1-P2.54-LS7.0-TL]
U39  EL357N(B)(TA)-G  [OPTO-SMD-4_L4.4-W4.1-P2.54-LS7.0-TL]
U40  EL357N(B)(TA)-G  [OPTO-SMD-4_L4.4-W4.1-P2.54-LS7.0-TL]
sheet Headers
U57  PM254-2-10-Z-8.5  [HDR-TH_20P-P2.54-V-F-R2-C10-S2.54]
U58  PM254-2-06-Z-8.5  [HDR-TH_12P-P2.54-V-F-R2-C6-S2.54]
sheet LED
LED18  17-215SURC/S530-A2/TR8  [LED0805-RD_RED]
LED19  17-215SURC/S530-A2/TR8  [LED0805-RD_RED]
LED20  17-215SURC/S530-A2/TR8  [LED0805-RD_RED]
LED21  17-215SURC/S530-A2/TR8  [LED0805-RD_RED]
LED22  17-215SURC/S530-A2/TR8  [LED0805-RD_RED]
LED23  17-215SURC/S530-A2/TR8  [LED0805-RD_RED]
LED24  SZYY0805YG  [LED0805-R-RD_GREEN]
LED25  17-215SURC/S530-A2/TR8  [LED0805-RD_RED]
LED26  SZYY0805YG  [LED0805-R-RD_GREEN]
LED27  XL-5050RGBC-WS2812B  [LED-SMD_4P-L5.0-W5.0-BL_XL-5050RGBC]
R138  270Ω  [R0805]
R139  620Ω  [R0805]
R140  620Ω  [R0805]
R141  2.2kΩ  [R1206]
R142  4.7kΩ  [R1206]
R143  1kΩ  [R0805]
R144  1kΩ  [R0805]
R145  1kΩ  [R0805]
R146  1kΩ  [R0805]
sheet Pilot-Lamp
CN24  DB2ERC-5.08-2P-GN  [CONN-TH_2P-P5.08_DB2ERC-5.08-2P]
CN25  DB2ERC-5.08-2P-GN  [CONN-TH_2P-P5.08_DB2ERC-5.08-2P]
CN26  DB2ERC-5.08-2P-GN  [CONN-TH_2P-P5.08_DB2ERC-5.08-2P]
D45  SS54  [SMA_L4.4-W2.8-LS5.4-R-RD]
D46  SS54  [SMA_L4.4-W2.8-LS5.4-R-RD]
D47  SS54  [SMA_L4.4-W2.8-LS5.4-R-RD]
H2  2.54-1*3P针  [HDR-TH_3P-P2.54-V-M-1]
H3  2.54-1*3P针  [HDR-TH_3P-P2.54-V-M-1]
H4  2.54-1*3P针  [HDR-TH_3P-P2.54-V-M-1]
LED28  NCD0805R1  [LED0805-R-RD]
LED29  NCD0805R1  [LED0805-R-RD]
LED30  NCD0805R1  [LED0805-R-RD]
Q23  IRF5305STRLPBF  [TO-263-2_L10.0-W9.1-P5.08-LS15.2-TL]
Q24  MMSS8050-L-TP  [SOT-23-3_L2.9-W1.3-P1.90-LS2.4-BR]
Q25  IRF5305STRLPBF  [TO-263-2_L10.0-W9.1-P5.08-LS15.2-TL]
Q26  MMSS8050-L-TP  [SOT-23-3_L2.9-W1.3-P1.90-LS2.4-BR]
Q27  IRF5305STRLPBF  [TO-263-2_L10.0-W9.1-P5.08-LS15.2-TL]
Q28  MMSS8050-L-TP  [SOT-23-3_L2.9-W1.3-P1.90-LS2.4-BR]
R147  4.7kΩ  [R0805]
R148  2kΩ  [R0805]
R149  10kΩ  [R0603]
R150  4.7kΩ  [R0805]
R151  1kΩ  [R0603]
R152  100kΩ  [R0805]
R153  4.7kΩ  [R0805]
R154  2kΩ  [R0805]
R155  4.7kΩ  [R0805]
R156  10kΩ  [R0603]
R157  1kΩ  [R0603]
R158  100kΩ  [R0805]
R159  4.7kΩ  [R0805]
R160  2kΩ  [R0805]
R161  4.7kΩ  [R0805]
R162  10kΩ  [R0603]
R163  1kΩ  [R0603]
R164  100kΩ  [R0805]
U54  CYPC817(C-TP2)  [SOP-4_L6.4-W4.6-P2.54-LS10.2-TL]
U55  CYPC817(C-TP2)  [SOP-4_L6.4-W4.6-P2.54-LS10.2-TL]
U56  CYPC817(C-TP2)  [SOP-4_L6.4-W4.6-P2.54-LS10.2-TL]
sheet Temp/Pressure-Sensor
C60  1uF  [C0603]
C61  100nF  [C0603]
R42  10kΩ  [R0603]
R43  10kΩ  [R0603]
U32  BMP280  [LGA-8_L2.5-W2.0-P0.65_AMP6127]

## Library data of the parts
C62 C63 C66 C67 = CC0603JRNPO9BN100: LCSC Part Name: 10pF ±5% 50V; Supplier Part: C106245; Manufacturer: YAGEO(国巨); Supplier Footprint: 0603; JLCPCB Part Class: Extended Part; Datasheet: https://atta.szlcsc.com/upload/public/pdf/source/20170505/1493957838062.pdf; Supplier: LCSC; Tolerance: ±5%
C64 = GRM155R71H104KE14D: LCSC Part Name: 100nF ±10% 50V; Supplier Part: C77020; Manufacturer: muRata(村田); Supplier Footprint: 0402; JLCPCB Part Class: Extended Part; Datasheet: https://atta.szlcsc.com/upload/public/pdf/source/20180326/C77020_39BD49C951FF1AF0DB1F1FAC5AC1E401.pdf; Supplier: LCSC; Tolerance: ±10%
C65 = HGC0402R5105K250NTEJ: LCSC Part Name: 1uF ±10% 25V; Supplier Part: C7472946; Manufacturer: Chinocera(华瓷); Supplier Footprint: 0402; JLCPCB Part Class: Extended Part; Datasheet: https://atta.szlcsc.com/upload/public/pdf/source/20240320/FAC3FEC40A78BC5CCCE96C232A94D860.pdf; Supplier: LCSC; Tolerance: ±10%
CN2-CN13 CN24-CN26 = DB2ERC-5.08-2P-GN: LCSC Part Name: 5.08mm 1x2P 排数:1 每排P数:2; Supplier Part: C395737; Manufacturer: DORABO(地博电气); Supplier Footprint: 弯插,P=5.08mm; JLCPCB Part Class: Extended Part; Datasheet: https://atta.szlcsc.com/upload/public/pdf/source/20230327/49BCB2D820551F12B61E36BBA9DDD5A2.pdf; Supplier: LCSC; Connector Type: 板端/Receptacle-Close; Structure: 1x2P; Pitch: 5.08mm; Color: Green; Mounting Style: Bend; Number of Pins: 2P; Number of Rows: 1; Number of PINs Per Row: 2; Current Rating (Max): 20A; Voltage Rating (Max): 320V; Operating Temperature Range: -40℃~+105℃
D17 D18 D21 D22 = BAT54S,215: LCSC Part Name: 电压:30V 电流:200mA; Supplier Part: C47546; Manufacturer: Nexperia(安世); Supplier Footprint: SOT-23; JLCPCB Part Class: Extended Part; Datasheet: https://atta.szlcsc.com/upload/public/pdf/source/20180326/C130910_AAC331EF45C4B7D7866DD336DA3C5D86.pdf; Supplier: LCSC; Diode Configuration: 1对串联式; Forward Voltage (Vf@If): 800mV@100mA; Reverse Voltage (Vr): 30V; Average Rectified Current (Io): 200mA; Reverse Leakage Current (Ir): 2uA@25V
D19 D20 D23 D24 = SMAJ33A_C353454: LCSC Part Name: 单向TVS 33V截止 7.5A峰值脉冲; Supplier Part: C353454; Manufacturer: 晶导微电子; Supplier Footprint: SMA; JLCPCB Part Class: Extended Part; Datasheet: https://atta.szlcsc.com/upload/public/pdf/source/20190103/C353498_9C52E1B7CA7D9691073072057BB1DA1A.pdf; Supplier: LCSC; Reverse Stand-Off Voltage (Vrwm): 33V; Maximum Clamping Voltage: 53.3V; Peak Pulse Current (Ipp)@10/1000us: 7.5A; Peak Pulse Power Dissipation (Ppp)@10/1000us: 400W; Breakdown Voltage: 36.7V; Reverse Leakage Current (Ir): 1uA; Type: TVS
R44 R45 R48 R49 = AR03BTCX1500: Resistance: Tolerance:±0.1% Tolerance:±0.1% Power(Watts): Temperature Coefficient:±25ppm/℃ Temperature Coefficient:±25ppm/℃; LCSC Part Name: 150Ω ±0.1% 100mW; Supplier Part: C319859; Manufacturer: Viking(光颉); Supplier Footprint: 0603; JLCPCB Part Class: Extended Part; Datasheet: https://atta.szlcsc.com/upload/public/pdf/source/20191129/C465721_10D49275DB41E427863CE9C8D788770A.pdf; Supplier: LCSC; Tolerance: ±0.1%; Temperature Coefficient: ±25ppm/℃; Type: Thin Film Resistor; Operating Temperature Range: -55℃~+155℃
R46 R47 R149 R156 R162 = RC0603FR-0710KL: Type:Thick Film Resistors Resistance: Tolerance:±1% Tolerance:±1% Power(Watts): Overload Voltage (Max): Temperature Coefficient:±100ppm/℃ Temperature Coefficient:±100ppm/℃ Operating Temperature Range:-55℃~+155℃ Operating Temperature Range:-55℃~+155℃; LCSC Part Name: 厚膜电阻 10kΩ ±1% 100mW; Supplier Part: C98220; Manufacturer: YAGEO(国巨); Supplier Footprint: 0603; JLCPCB Part Class: Extended Part; Datasheet: https://atta.szlcsc.com/upload/public/pdf/source/20180927/C295883_E8D83085EA81BD7DE0B2B681138C15EE.pdf; Supplier: LCSC; Type: Thick Film Resistors; Tolerance: ±1%; Temperature Coefficient: ±100ppm/℃; Operating Temperature Range: -55℃~+155℃
U33 = ADS1115IDGSR: LCSC Part Name: 具有内部基准、振荡器和可编程比较器且兼容 I2C 的ADS111x、超小型、低功耗 860SPS、16位ADC; Supplier Part: C37593; Manufacturer: TI(德州仪器); Supplier Footprint: VSSOP-10; JLCPCB Part Class: Extended Part; Datasheet: https://www.ti.com/cn/lit/gpn/ads1115; Supplier: LCSC; Interface: I2C; differential input: Yes; number of channels: 2; Supply Voltage: 2V~5.5V; sampling frequency: 860Hz; resolution: 16Bit; Operating Temperature: -40℃~+125℃
C60 C68 = C0603X5R105K250NT: Capacitance: Tolerance:±10% Tolerance:±10% Voltage Rated: Temperature Coefficient:; LCSC Part Name: 1uF ±10% 25V; Supplier Part: C466771; Manufacturer: SANYEAR(叁叶源); Supplier Footprint: 0603; JLCPCB Part Class: Extended Part; Datasheet: https://atta.szlcsc.com/upload/public/pdf/source/20200102/C475251_1E30ECAC0E8AE7254982658A02A2D78C.pdf; Supplier: LCSC; Tolerance: ±10%
C61 C69-C71 = CL10B104KB8NNNC: Capacitance: Tolerance:±10% Tolerance:±10% Voltage Rated: Temperature Coefficient:; LCSC Part Name: 100nF ±10% 50V; Supplier Part: C1591; Manufacturer: SAMSUNG(三星); Supplier Footprint: 0603; JLCPCB Part Class: Extended Part; Datasheet: https://atta.szlcsc.com/upload/public/pdf/source/20160218/1457707763339.pdf; Supplier: LCSC; Tolerance: ±10%
D25 D26 = SMBJ12A_C908793: Supplier Part: C908793; Manufacturer: GOODWORK(固得沃克); Supplier Footprint: SMB(DO-214AA); JLCPCB Part Class: Extended Part; Datasheet: https://atta.szlcsc.com/upload/public/pdf/source/20201231/C908783_5F0AE07776753216FC0A4122EEBBB8E2.pdf; Supplier: LCSC; Reverse Stand-Off Voltage (Vrwm): 12V; Maximum Clamping Voltage: 19.9V; Peak Pulse Current (Ipp)@10/1000us: 30.2A; Breakdown Voltage: 13.3V; Reverse Leakage Current (Ir): 5uA; Type: TVS
R50-R52 = RC0603FR-074K7L: Type:Thick Film Resistors Resistance: Tolerance:±1% Tolerance:±1% Power(Watts): Overload Voltage (Max): Temperature Coefficient:±100ppm/℃ Temperature Coefficient:±100ppm/℃ Operating Temperature Range:-55℃~+155℃ Operating Temperature Range:-55℃~+155℃; LCSC Part Name: 厚膜电阻 4.7kΩ ±1% 100mW; Supplier Part: C99782; Manufacturer: YAGEO(国巨); Supplier Footprint: 0603; JLCPCB Part Class: Extended Part; Datasheet: https://atta.szlcsc.com/upload/public/pdf/source/20180224/C181757_15194369480721363983.pdf; Supplier: LCSC; Type: Thick Film Resistors; Tolerance: ±1%; Temperature Coefficient: ±100ppm/℃; Operating Temperature Range: -55℃~+155℃
U34 = GP8413-TC50-EW_C5464816: Supplier Part: C5464816; Manufacturer: Guestgood(客益); Supplier Footprint: ESOP-10; JLCPCB Part Class: Extended Part; Datasheet: https://atta.szlcsc.com/upload/public/pdf/source/20230428/755384A039167451CDBE5BEBA984E79E.pdf; Supplier: LCSC; Interface: I2C
D27-D32 = CD4148WSP_C109001: LCSC Part Name: 电压:75V 电流:150mA; Supplier Part: C109001; Manufacturer: LIZ(丽智电子); Supplier Footprint: 0805; JLCPCB Part Class: Extended Part; Datasheet: https://atta.szlcsc.com/upload/public/pdf/source/20170510/1494399695091.pdf; Supplier: LCSC; Forward Voltage (Vf@If): 1.25V@100mA; Reverse Leakage Current: 5uA@75V
LED1-LED6 = LTST-C170TBKT: LCSC Part Name: 蓝灯; Supplier Part: C98222; Manufacturer: LITEON(光宝); Supplier Footprint: 0805; JLCPCB Part Class: Extended Part; Datasheet: https://atta.szlcsc.com/upload/public/pdf/source/20171026/C98222_15089842934011059296.pdf; Supplier: LCSC; Emitted Color: Blue; Forward Voltage (VF): 3.3V; Power Dissipation: 76mW; Forward Current: 20mA; Dominant Wavelength: 465nm~475nm; Peak Wavelength: 468nm; Lens Color: 无色透明透镜; Luminous Intensity: 104mcd; Viewing Angle: 130°; Operating Temperature: -20℃~+80℃
R53 R54 R61 R62 R69 R70 = RS-05K472JT: LCSC Part Name: 厚膜电阻 4.7kΩ ±5% 125mW; Supplier Part: C115310; Manufacturer: FH(风华); Supplier Footprint: 0805; JLCPCB Part Class: Extended Part; Datasheet: https://atta.szlcsc.com/upload/public/pdf/source/20140616/1457707091974.pdf; Supplier: LCSC; Type: Thick Film Resistors; Tolerance: ±5%; Temperature Coefficient: ±100ppm/℃; Operating Temperature Range: -55℃~+155℃
R55 R56 R63 R64 R71 R73 = RTT05101JTP: LCSC Part Name: 厚膜电阻 100Ω ±5% 125mW; Supplier Part: C103909; Manufacturer: RALEC(旺诠); Supplier Footprint: 0805; JLCPCB Part Class: Extended Part; Datasheet: https://atta.szlcsc.com/upload/public/pdf/source/20191219/C158410_884373A5B7E1BC76BF57BC45A946C093.pdf; Supplier: LCSC; Type: Thick Film Resistors; Tolerance: ±5%; Temperature Coefficient: ±100ppm/℃; Operating Temperature Range: -55℃~+155℃
R57-R60 R65-R68 R72 R74-R76 = 0805W8F1002T5E: Type:Thick Film Resistors Resistance:10kΩ Tolerance:±1% Tolerance:±1% Power(Watts): Overload Voltage (Max): Temperature Coefficient:±100ppm/℃ Temperature Coefficient:±100ppm/℃ Operating Temperature Range:-55℃~+155℃ Operating Temperature Range:-55℃~+155℃; LCSC Part Name: 10kΩ ±1% 125mW 厚膜电阻; Supplier Part: C17414; Manufacturer: UNI-ROYAL(厚声); Supplier Footprint: 0805; JLCPCB Part Class: Basic Part; Datasheet: https://atta.szlcsc.com/upload/public/pdf/source/20200306/C422600_1E6D84923E4A46A82E41ADD87F860B5C.pdf; Supplier: LCSC; Type: Thick Film Resistors; Tolerance: ±1%; Temperature Coefficient: ±100ppm/℃; Operating Temperature Range: -55℃~+155℃
U35-U40 = EL357N(B)(TA)-G: LCSC Part Name: DC输入 隔离电压(rms):3750V; Supplier Part: C6649; Manufacturer: EVERLIGHT(亿光); Supplier Footprint: SOP-4-2.54mm; JLCPCB Part Class: Basic Part; Datasheet: https://atta.szlcsc.com/upload/public/pdf/source/20120405/1457706466151.pdf; Supplier: LCSC; Input voltage type: DC; Output Type: 光电三极管; Forward Voltage: 1.2V; Output Current: 50mA; Isolation Voltage(rms): 3.75kV; Reverse Voltage: 6V; Receiving End Voltage: 80V; Number of Outputs: 1; Collector-Emitter Saturation Voltage (Vce(sat)@Ic,IF): 100mV@1mA,20mA; Rise time: 3us@2mA,100Ω; Fall time: 4us@2mA,100Ω; Operating Temperature: -55℃~+110℃
U57 = PM254-2-10-Z-8.5: LCSC Part Name: 2x10P 间距:2.54mm 直插; Supplier Part: C2897411; Manufacturer: HCTL(华灿天禄); Supplier Footprint: 插件,P=2.54mm; JLCPCB Part Class: Extended Part; Datasheet: https://atta.szlcsc.com/upload/public/pdf/source/20230609/3D36CA2C1BFC9FD1C3F709AD9DFEB9C2.pdf; Supplier: LCSC; Holes Structure: 2x10P; Pitch: 2.54mm; Row Spacing: 2.54mm; Circular Hole / Square Hole: Square Holes; Mounting Type: Straight; Number of Rows: 双排; Number of Holes: 20P; Current Rating (Max): 3A; Holes Direction: Top; Insulation Height: 8.5mm; Contact Material: Copper Alloy; Operating Temperature Range: -40℃~+105℃; Soldering Temperature(Max): 260℃@5S
U58 = PM254-2-06-Z-8.5: LCSC Part Name: 2x6P 间距:2.54mm 直插; Supplier Part: C2897407; Manufacturer: HCTL(华灿天禄); Supplier Footprint: 插件,P=2.54mm; JLCPCB Part Class: Extended Part; Datasheet: https://atta.szlcsc.com/upload/public/pdf/source/20230609/3D36CA2C1BFC9FD1C3F709AD9DFEB9C2.pdf; Supplier: LCSC; Holes Structure: 2x6P; Pitch: 2.54mm; Row Spacing: 2.54mm; Circular Hole / Square Hole: Square Holes; Mounting Type: Straight; Number of Rows: 双排; Number of Holes: 12P; Current Rating (Max): 3A; Holes Direction: Top; Insulation Height: 8.5mm; Contact Material: Copper Alloy; Operating Temperature Range: -40℃~+105℃; Soldering Temperature(Max): 260℃@5S
LED18-LED23 LED25 = 17-215SURC/S530-A2/TR8: LCSC Part Name: 红灯; Supplier Part: C142306; Manufacturer: EVERLIGHT(亿光); Supplier Footprint: 0805; JLCPCB Part Class: Extended Part; Datasheet: https://atta.szlcsc.com/upload/public/pdf/source/20171110/C142306_15102792678801104249.pdf; Supplier: LCSC; Emitted Color: Red
LED24 LED26 = SZYY0805YG: LCSC Part Name: 普绿/黄绿; Supplier Part: C434435; Manufacturer: yongyu(永裕光电); Supplier Footprint: 0805; JLCPCB Part Class: Extended Part; Datasheet: https://atta.szlcsc.com/upload/public/pdf/source/20191204/C434435_1187404D4D35A500174CD35CE47973D5.pdf; Supplier: LCSC; Emitted Color: Green-yellow
LED27 = XL-5050RGBC-WS2812B: Supplier Part: C2843785; Manufacturer: XINGLIGHT(成兴光); Supplier Footprint: SMD5050; JLCPCB Part Class: Extended Part; Datasheet: https://atta.szlcsc.com/upload/public/pdf/source/20240412/E1004CAA80592E31D08BFE019083806F.pdf; Supplier: LCSC
R138 = RC0805FR-07270RL: LCSC Part Name: 厚膜电阻 270Ω ±1% 125mW; Supplier Part: C137558; Manufacturer: YAGEO(国巨); Supplier Footprint: 0805; JLCPCB Part Class: Extended Part; Datasheet: https://atta.szlcsc.com/upload/public/pdf/source/20180821/C275644_0D56F95EFF785E7D9A1FEF436B37DA78.pdf; Supplier: LCSC; Type: Thick Film Resistors; Tolerance: ±1%; Temperature Coefficient: ±100ppm/℃; Operating Temperature Range: -55℃~+155℃
R139 R140 = 0805W8F6200T5E: LCSC Part Name: 620Ω ±1% 125mW 厚膜电阻; Supplier Part: C17782; Manufacturer: UNI-ROYAL(厚声); Supplier Footprint: 0805; JLCPCB Part Class: Extended Part; Datasheet: https://atta.szlcsc.com/upload/public/pdf/source/20200306/C422600_1E6D84923E4A46A82E41ADD87F860B5C.pdf; Supplier: LCSC; Type: Thick Film Resistors; Tolerance: ±1%; Temperature Coefficient: ±100ppm/℃; Operating Temperature Range: -55℃~+155℃
R141 = RC1206FR-072K2L: LCSC Part Name: 厚膜电阻 2.2kΩ ±1% 250mW; Supplier Part: C114933; Manufacturer: YAGEO(国巨); Supplier Footprint: 1206; JLCPCB Part Class: Extended Part; Datasheet: https://atta.szlcsc.com/upload/public/pdf/source/20180821/C275644_0D56F95EFF785E7D9A1FEF436B37DA78.pdf; Supplier: LCSC; Type: Thick Film Resistors; Tolerance: ±1%; Power(Watts): 250mW; Temperature Coefficient: ±100ppm/℃; Operating Temperature Range: -55℃~+155℃
R142 = 1206W4F4701T5E: LCSC Part Name: 4.7kΩ ±1% 250mW 厚膜电阻; Supplier Part: C17936; Manufacturer: UNI-ROYAL(厚声); Supplier Footprint: 1206; JLCPCB Part Class: Basic Part; Datasheet: https://atta.szlcsc.com/upload/public/pdf/source/20200306/C422600_1E6D84923E4A46A82E41ADD87F860B5C.pdf; Supplier: LCSC; Type: Thick Film Resistors; Tolerance: ±1%; Temperature Coefficient: ±100ppm/℃; Operating Temperature Range: -55℃~+155℃
R143-R146 = 0805W8J0102T5E: Type:Thick Film Resistors Resistance:1kΩ Tolerance:±5% Tolerance:±5% Power(Watts): Overload Voltage (Max): Temperature Coefficient:±100ppm/℃ Temperature Coefficient:±100ppm/℃ Operating Temperature Range:-55℃~+155℃ Operating Temperature Range:-55℃~+155℃; LCSC Part Name: 1kΩ ±5% 125mW 厚膜电阻; Supplier Part: C25623; Manufacturer: UNI-ROYAL(厚声); Supplier Footprint: 0805; JLCPCB Part Class: Extended Part; Datasheet: https://atta.szlcsc.com/upload/public/pdf/source/20200306/C422600_1E6D84923E4A46A82E41ADD87F860B5C.pdf; Supplier: LCSC; Type: Thick Film Resistors; Tolerance: ±5%; Temperature Coefficient: ±100ppm/℃; Operating Temperature Range: -55℃~+155℃
D45-D47 = SS54_C22452: LCSC Part Name: 电压:40V 电流:5A; Supplier Part: C22452; Manufacturer: MDD(辰达半导体); Supplier Footprint: SMA(DO-214AC); JLCPCB Part Class: Basic Part; Datasheet: https://atta.szlcsc.com/upload/public/pdf/source/20230314/529CD85F9B31F69841D3A079BC07E377.pdf; Supplier: LCSC; Diode Configuration: Single; Forward Voltage (Vf@If): 550mV@5A; Reverse Voltage (Vr): 40V; Rectified Current: 5A; Reverse Leakage Current (Ir): 1mA@40V
H2-H4 = 2.54-1*3P针: LCSC Part Name: 间距:2.54mm 1x3P 直插 方针; Supplier Part: C49257; Manufacturer: BOOMELE(博穆精密); Supplier Footprint: 插件,P=2.54mm; JLCPCB Part Class: Extended Part; Datasheet: https://atta.szlcsc.com/upload/public/pdf/source/20221018/3E9408392E35E6F57A28985E5F7BF5C9.pdf; Supplier: LCSC; Pin Structure: 1x3P; Pitch: 2.54mm; Circluar Pins/Square Pins: Square Pins; Mounting Type: Straight; Number of Rows: Plugin; Number of Pins: 3P; Current Rating (Max): 3A; Operating Temperature Range: -40℃~+105℃; Color: Black
LED28-LED30 = NCD0805R1_C84256: Supplier Part: C84256; Manufacturer: 国星光电; Supplier Footprint: 0805; JLCPCB Part Class: Basic Part; Datasheet: https://atta.szlcsc.com/upload/public/pdf/source/20200820/C84256_F0A75A43B3EAD75808600A0514C76B99.pdf; Supplier: LCSC; Emitted Color: Red; Forward Voltage (VF): 1.6V~2.6V; Power Dissipation: 65mW; Forward Current: 20mA; Dominant Wavelength: 615nm~630nm; Diode Configuration: 独立二极管; Lens Color: 无色透明透镜; Luminous Intensity: 67mcd~195mcd; Viewing Angle: 130°; Operating Temperature: -30℃~+85℃
Q23 Q25 Q27 = IRF5305STRLPBF: LCSC Part Name: 1个P沟道 耐压:55V 电流:31A; Supplier Part: C41224; Manufacturer: Infineon(英飞凌); Supplier Footprint: TO-263-2; JLCPCB Part Class: Extended Part; Datasheet: https://atta.szlcsc.com/upload/public/pdf/source/20200525/C537772_8AE22919435F731062AFC622E6C287B5.pdf; Supplier: LCSC; Type: 1个PChannel; Power Dissipation (Pd): ；; Drain Source On Resistance (RDS(on)@Vgs,Id): 60mΩ@10V,16A; Gate Threshold Voltage (Vgs(th)@Id): 4V@250uA; Total Gate Charge (Qg@Vgs): 63nC@10V; Input Capacitance (Ciss@Vds): 1.2nF@25V; Operating Temperature: -55℃~+175℃@(Tj)
Q24 Q26 Q28 = MMSS8050-L-TP: LCSC Part Name: 耐压:25V 电流:1.5A NPN; Supplier Part: C194044; Manufacturer: MCC(美微科); Supplier Footprint: SOT-23; JLCPCB Part Class: Extended Part; Datasheet: https://atta.szlcsc.com/upload/public/pdf/source/20180629/C194044_254F8BF82F81D50CDD7AC87A069B0CC8.pdf; Supplier: LCSC; DC Current Gain (hFE@Ic,Vce): 120@100mA,1V; Transition Frequency (fT): 100MHz; Collector Cut-Off Current (Icbo): 100nA; Collector-Emitter Saturation Voltage (VCE(sat)@Ic,Ib): 500mV@800mA,80mA; Operating Temperature: -55℃~+150℃@(Tj)
R147 R150 R153 R155 R159 R161 = 0805W8F4701T5E: LCSC Part Name: 4.7kΩ ±1% 125mW 厚膜电阻; Supplier Part: C17673; Manufacturer: UNI-ROYAL(厚声); Supplier Footprint: 0805; JLCPCB Part Class: Basic Part; Datasheet: https://atta.szlcsc.com/upload/public/pdf/source/20200306/C422600_1E6D84923E4A46A82E41ADD87F860B5C.pdf; Supplier: LCSC; Type: Thick Film Resistors; Tolerance: ±1%; Temperature Coefficient: ±100ppm/℃; Operating Temperature Range: -55℃~+155℃
R148 R154 R160 = 0805W8F2001T5E: LCSC Part Name: 2kΩ ±1% 125mW 厚膜电阻; Supplier Part: C17604; Manufacturer: UNI-ROYAL(厚声); Supplier Footprint: 0805; JLCPCB Part Class: Basic Part; Datasheet: https://atta.szlcsc.com/upload/public/pdf/source/20200306/C422600_1E6D84923E4A46A82E41ADD87F860B5C.pdf; Supplier: LCSC; Type: Thick Film Resistors; Tolerance: ±1%; Temperature Coefficient: ±100ppm/℃; Operating Temperature Range: -55℃~+155℃
R151 R157 R163 = RC0603FR-071KL: Type:Thick Film Resistors Resistance: Tolerance:±1% Tolerance:±1% Power(Watts): Overload Voltage (Max): Temperature Coefficient:±100ppm/℃ Temperature Coefficient:±100ppm/℃ Operating Temperature Range:-55℃~+155℃ Operating Temperature Range:-55℃~+155℃; LCSC Part Name: 厚膜电阻 1kΩ ±1% 100mW; Supplier Part: C22548; Manufacturer: YAGEO(国巨); Supplier Footprint: 0603; JLCPCB Part Class: Extended Part; Datasheet: https://atta.szlcsc.com/upload/public/pdf/source/20180316/70C0E2BDAE7FCC62C531A5A58D202EE1.pdf; Supplier: LCSC; Type: Thick Film Resistors; Tolerance: ±1%; Temperature Coefficient: ±100ppm/℃; Operating Temperature Range: -55℃~+155℃
R152 R158 R164 = 0805W8F1003T5E: Type:Thick Film Resistors Resistance:100kΩ Tolerance:±1% Tolerance:±1% Power(Watts): Overload Voltage (Max): Temperature Coefficient:±100ppm/℃ Temperature Coefficient:±100ppm/℃ Operating Temperature Range:-55℃~+155℃ Operating Temperature Range:-55℃~+155℃; LCSC Part Name: 100kΩ ±1% 125mW 厚膜电阻; Supplier Part: C149504; Manufacturer: UNI-ROYAL(厚声); Supplier Footprint: 0805; JLCPCB Part Class: Basic Part; Datasheet: https://atta.szlcsc.com/upload/public/pdf/source/20200306/C422600_1E6D84923E4A46A82E41ADD87F860B5C.pdf; Supplier: LCSC; Type: Thick Film Resistors; Tolerance: ±1%; Temperature Coefficient: ±100ppm/℃; Operating Temperature Range: -55℃~+155℃
U54-U56 = CYPC817(C-TP2): LCSC Part Name: DC输入 隔离电压(rms):5000V; Supplier Part: C385058; Manufacturer: OCIC(卓睿科); Supplier Footprint: SOP-4-2.54mm; JLCPCB Part Class: Extended Part; Datasheet: https://atta.szlcsc.com/upload/public/pdf/source/20190506/C385060_B90B33F1509846872C073ED092D72063.pdf; Supplier: LCSC; Input voltage type: DC; Output Type: 光电三极管; Forward Voltage: 1.2V; Output Current: 50mA; Isolation Voltage(rms): 5kV; Reverse Voltage: 6V; Receiving End Voltage: 80V; Number of Outputs: 1; Collector-Emitter Saturation Voltage (Vce(sat)@Ic,IF): 100mV@5mA,2mA; Rise time: 4us@2mA,100Ω; Fall time: 3us@2mA,100Ω; Operating Temperature: -55℃~+110℃
R42 R43 = CR0603FA1002G: Type:Thick Film Resistors Resistance: Tolerance:±1% Tolerance:±1% Power(Watts): Overload Voltage (Max): Temperature Coefficient:±100ppm/℃ Temperature Coefficient:±100ppm/℃ Operating Temperature Range:-55℃~+125℃ Operating Temperature Range:-55℃~+125℃; LCSC Part Name: 厚膜电阻 10kΩ ±1% 100mW; Supplier Part: C126901; Manufacturer: LIZ(丽智电子); Supplier Footprint: 0603; JLCPCB Part Class: Extended Part; Datasheet: https://atta.szlcsc.com/upload/public/pdf/source/20180403/C189438_6D658388CC7843F35BBC9018D03F0B8E.pdf; Supplier: LCSC; Type: Thick Film Resistors; Tolerance: ±1%; Temperature Coefficient: ±100ppm/℃; Operating Temperature Range: -55℃~+125℃
U32 = BMP280: Supplier Part: C83291; Manufacturer: Bosch(博世); Supplier Footprint: LGA-8(2x2.5); JLCPCB Part Class: Extended Part; Datasheet: https://atta.szlcsc.com/upload/public/pdf/source/20200702/C83291_F39E84AB7DFC569A4C7554F8659640A1.pdf; Supplier: LCSC

## Nets
3V3: C60.2 C61.2 C64.2 C65.2 D17.2(K) D18.2(K) D21.2(K) D22.2(K) R42.2 R46.1 R138.2 R143.2 R144.2 R145.2 R146.2 R147.1 R148.2 R153.1 R154.2 R159.1 R160.2 U32.6(VDDIO) U32.8(VDD) U33.8(VDD) U35.4(COL) U36.4(COL) U37.4(COL) U38.4(COL) U39.4(COL) U40.4(COL) U57.5 U57.6 U58.5 U58.6 ; also on sheet 1 2 5 6 7 8 9 10
+5V: LED27.1(VDD) R139.2 U57.1 U57.2 U58.1 U58.2 ; also on sheet 1 3 4
+5V(ISO): R140.2 ; also on sheet 1 5 9
+12V: C71.2 H2.1 H3.1 H4.1 R141.2 U34.5(VCC) ; also on sheet 1
+24V: H2.3 H3.3 H4.3 R142.2 ; also on sheet 1
GND: C60.1 C61.1 C62.1 C63.1 C64.1 C65.1 C66.1 C67.1 C68.2 C69.1 C70.1 C71.1 CN2.2 CN3.2 CN4.2 CN5.2 CN6.2 CN7.2 CN24.2 CN25.2 CN26.2 D17.1(A) D18.1(A) D19.2(A) D20.2(A) D21.1(A) D22.1(A) D23.2(A) D24.2(A) D25.2(A) D26.2(A) D45.1(A) D46.1(A) D47.1(A) LED18.1(K) LED19.1(K) LED21.1(K) LED22.1(K) LED27.3(GND) Q24.2(E) Q26.2(E) Q28.2(E) R43.2 R44.1 R45.1 R47.1 R48.1 R49.1 R50.2 R51.1 R52.1 R58.1 R59.1 R66.1 R68.1 R74.1 R76.1 R152.1 R158.1 R164.1 U32.1(GND) U32.7(GND) U33.3(GND) U34.6(GND) U34.11(EP) U54.3(EMI) U55.3(EMI) U56.3(EMI) U57.3 U57.4 U58.3 U58.4 ; also on sheet 1 2 3 4 5 6 7 8 9 10
GND(ISO): LED20.1(K) ; also on sheet 1 5 9
AI_SCL: U32.4(SCK) U33.10(SCL) U34.1(SCLK) ; also on sheet 2 6 8
AI_SDA: U32.3(SDI) U33.9(SDA) U34.2(SDA) ; also on sheet 2 6 8
AIN0: C62.2 CN2.1 D17.3(AK) D19.1(C) R44.2 U33.4(AIN0)
AIN1: C66.2 CN4.1 D21.3(AK) D23.1(C) R48.2 U33.5(AIN1)
AIN2: C63.2 CN3.1 D18.3(AK) D20.1(C) R45.2 U33.6(AIN2)
AIN3: C67.2 CN5.1 D22.3(AK) D24.1(C) R49.2 U33.7(AIN3)
DI_01: R55.1 ; also on sheet 8
DI_02: R63.1 ; also on sheet 8
DI_03: R71.1 ; also on sheet 8
DI_04: R56.1 ; also on sheet 8
DI_05: R64.1 ; also on sheet 8
DI_06: R73.1 ; also on sheet 8
EXTIO6: U57.15 U57.16 ; also on sheet 8
EXTIO7: U57.17 U57.18 ; also on sheet 8
EXTIO8: U57.19 U57.20 ; also on sheet 8
EXTIO9: R150.1 ; also on sheet 8
EXTIO10: R155.1 ; also on sheet 8
EXTIO11: R161.1 ; also on sheet 8
FL_MISO: U57.11 U57.12 ; also on sheet 2 7
FL_MOSI: U57.13 U57.14 ; also on sheet 2 7
FL_SCK: U57.9 U57.10 ; also on sheet 2 7
IO6: LED27.4(DIN) ; also on sheet 2
IO15: LED23.1(K) ; also on sheet 2 5
IO16: LED24.2(-) ; also on sheet 2 5
RXD0: LED26.2(-) U58.11 U58.12 ; also on sheet 2
TXD0: LED25.1(K) U58.9 U58.10 ; also on sheet 2
$12N3325: R46.2 U33.2(ALERT/RDY)
$12N3370: R47.2 U33.1(ADDR)
$13N615: R55.2 R58.2 U35.3(EM)
$13N620: LED1.2(A) U35.2(CAT)
$13N626: D27.1 R53.2 R57.2 U35.1(AN)
$13N631: CN8.2 D27.2 LED1.1(K) R57.1
$13N772: CN8.1 R53.1
$13N1143: R63.2 R66.2 U37.3(EM)
$13N1147: LED3.2(A) U37.2(CAT)
$13N1150: D29.1 R61.2 R65.2 U37.1(AN)
$13N1156: CN10.2 D29.2 LED3.1(K) R65.1
$13N1170: CN10.1 R61.1
$13N1859: R71.2 R74.2 U39.3(EM)
$13N1863: LED5.2(A) U39.2(CAT)
$13N1866: D31.1 R69.2 R72.2 U39.1(AN)
$13N1872: CN12.2 D31.2 LED5.1(K) R72.1
$13N1886: CN12.1 R69.1
$13N1891: R56.2 R59.2 U36.3(EM)
$13N1895: LED2.2(A) U36.2(CAT)
$13N1898: D28.1 R54.2 R60.2 U36.1(AN)
$13N1904: CN9.2 D28.2 LED2.1(K) R60.1
$13N1918: CN9.1 R54.1
$13N2609: R64.2 R68.2 U38.3(EM)
$13N2613: LED4.2(A) U38.2(CAT)
$13N2616: D30.1 R62.2 R67.2 U38.1(AN)
$13N2622: CN11.2 D30.2 LED4.1(K) R67.1
$13N2636: CN11.1 R62.1
$13N2641: R73.2 R76.2 U40.3(EM)
$13N2645: LED6.2(A) U40.2(CAT)
$13N2648: D32.1 R70.2 R75.2 U40.1(AN)
$13N2654: CN13.2 D32.2 LED6.1(K) R75.1
$13N2668: CN13.1 R70.1
$14N420: C68.1 U34.10(V5V)
$14N526: C70.2 CN7.1 D26.1(C) U34.7(VOUT1)
$14N704: C69.2 CN6.1 D25.1(C) U34.8(VOUT0)
$14N2334: R51.2 U34.3(A0)
$14N2339: R52.2 U34.4(A1)
$14N2685: R50.1 U34.9(A2)
$16N1068: LED18.2(A) R138.1
$16N1371: LED19.2(A) R139.1
$16N1404: LED21.2(A) R141.1
$16N1439: LED22.2(A) R142.1
$16N1856: LED23.2(A) R143.1
$16N1857: LED24.1(+) R144.1
$16N4393: LED25.2(A) R145.1
$16N4394: LED26.1(+) R146.1
$16N12247: LED20.2(A) R140.1
$17N1775: Q24.1(B) R150.2 R152.2
$17N1777: R147.2 U54.1(AN)
$17N1778: Q23.1(G) R151.2
$17N1779: R149.1 R151.1 U54.4(COL)
$17N1782: CN24.1 D45.2(K) Q23.4(D)
$17N1783: LED28.1(+) R148.1
$17N1786: H2.2 Q23.3(S) R149.2
$17N1788: LED28.2(-) Q24.3(C) U54.2(CAT)
$17N1790: Q26.1(B) R155.2 R158.2
$17N1792: R153.2 U55.1(AN)
$17N1793: Q25.1(G) R157.2
$17N1794: R156.1 R157.1 U55.4(COL)
$17N1797: CN25.1 D46.2(K) Q25.4(D)
$17N1798: LED29.1(+) R154.1
$17N1801: H3.2 Q25.3(S) R156.2
$17N1803: LED29.2(-) Q26.3(C) U55.2(CAT)
$17N1805: Q28.1(B) R161.2 R164.2
$17N1807: R159.2 U56.1(AN)
$17N1808: Q27.1(G) R163.2
$17N1809: R162.1 R163.1 U56.4(COL)
$17N1812: CN26.1 D47.2(K) Q27.4(D)
$17N1813: LED30.1(+) R160.1
$17N1815: LED30.2(-) Q28.3(C) U56.2(CAT)
$17N1816: H4.2 Q27.3(S) R162.2
$18N513: R42.1 U32.2(CSB)
$18N567: R43.1 U32.5(SDO)

Not connected (* = marked no-connect by the designer): LED27 2(DOU)*; U57 7* 8*; U58 7* 8*

## Notes on the sheets
sheet 11
- Analog Input (4-20mA)
- AI 1
- AI 3
- ADS1115
- AI 2
- AI 4
- ADDR : 0x48
- Links:
- 1. https://how2electronics.com/how-to-use-ads1115-16-bit-adc-module-with-arduino/
- 2. https://www.lcsc.com/datasheet/lcsc_datasheet_1809192322_Texas-Instruments-ADS1115IDGSR_C37593.pdf
sheet 12
- Digital Input (3 - 32VDC@5mA)
- DI 1
- DI 4
- DI 2
- DI 5
- DI 3
- DI 6
- Links:
- 1. https://www.makeriot2020.com/index.php/tag/diy/
sheet 13
- Analog Output (0-10v)
- GP8413
- ADDR : 0x58
- Links:
- 1. https://wiki.dfrobot.com/SKU_DFR1073_2_Channel_15bit_I2C_to_0-10V_DAC
- 2. https://www.lcsc.com/datasheet/lcsc_datasheet_2304281536_Guestgood-GP8413-TC50-EW_C5464816.pdf
sheet 14
- LoRa Header
- UART Header
sheet 15
- LED
- Power LED
- RS485 LED
- UART LED
- RGB LED
sheet 16
- Pilot Lamp
- (Running, Alarm and Stopped)
- LAMP 1
- LAMP 2
- LAMP 3
sheet 17
- Temperature & Pressure Sensor
- ADDR : 0x76
- Links:
- 1. https://docs.sunfounder.com/projects/umsk/en/latest/01_components_basic/20-component_bmp280.html
